# Altium project SMU_V4 - Copy.PrjPcb (part 1 of 2)
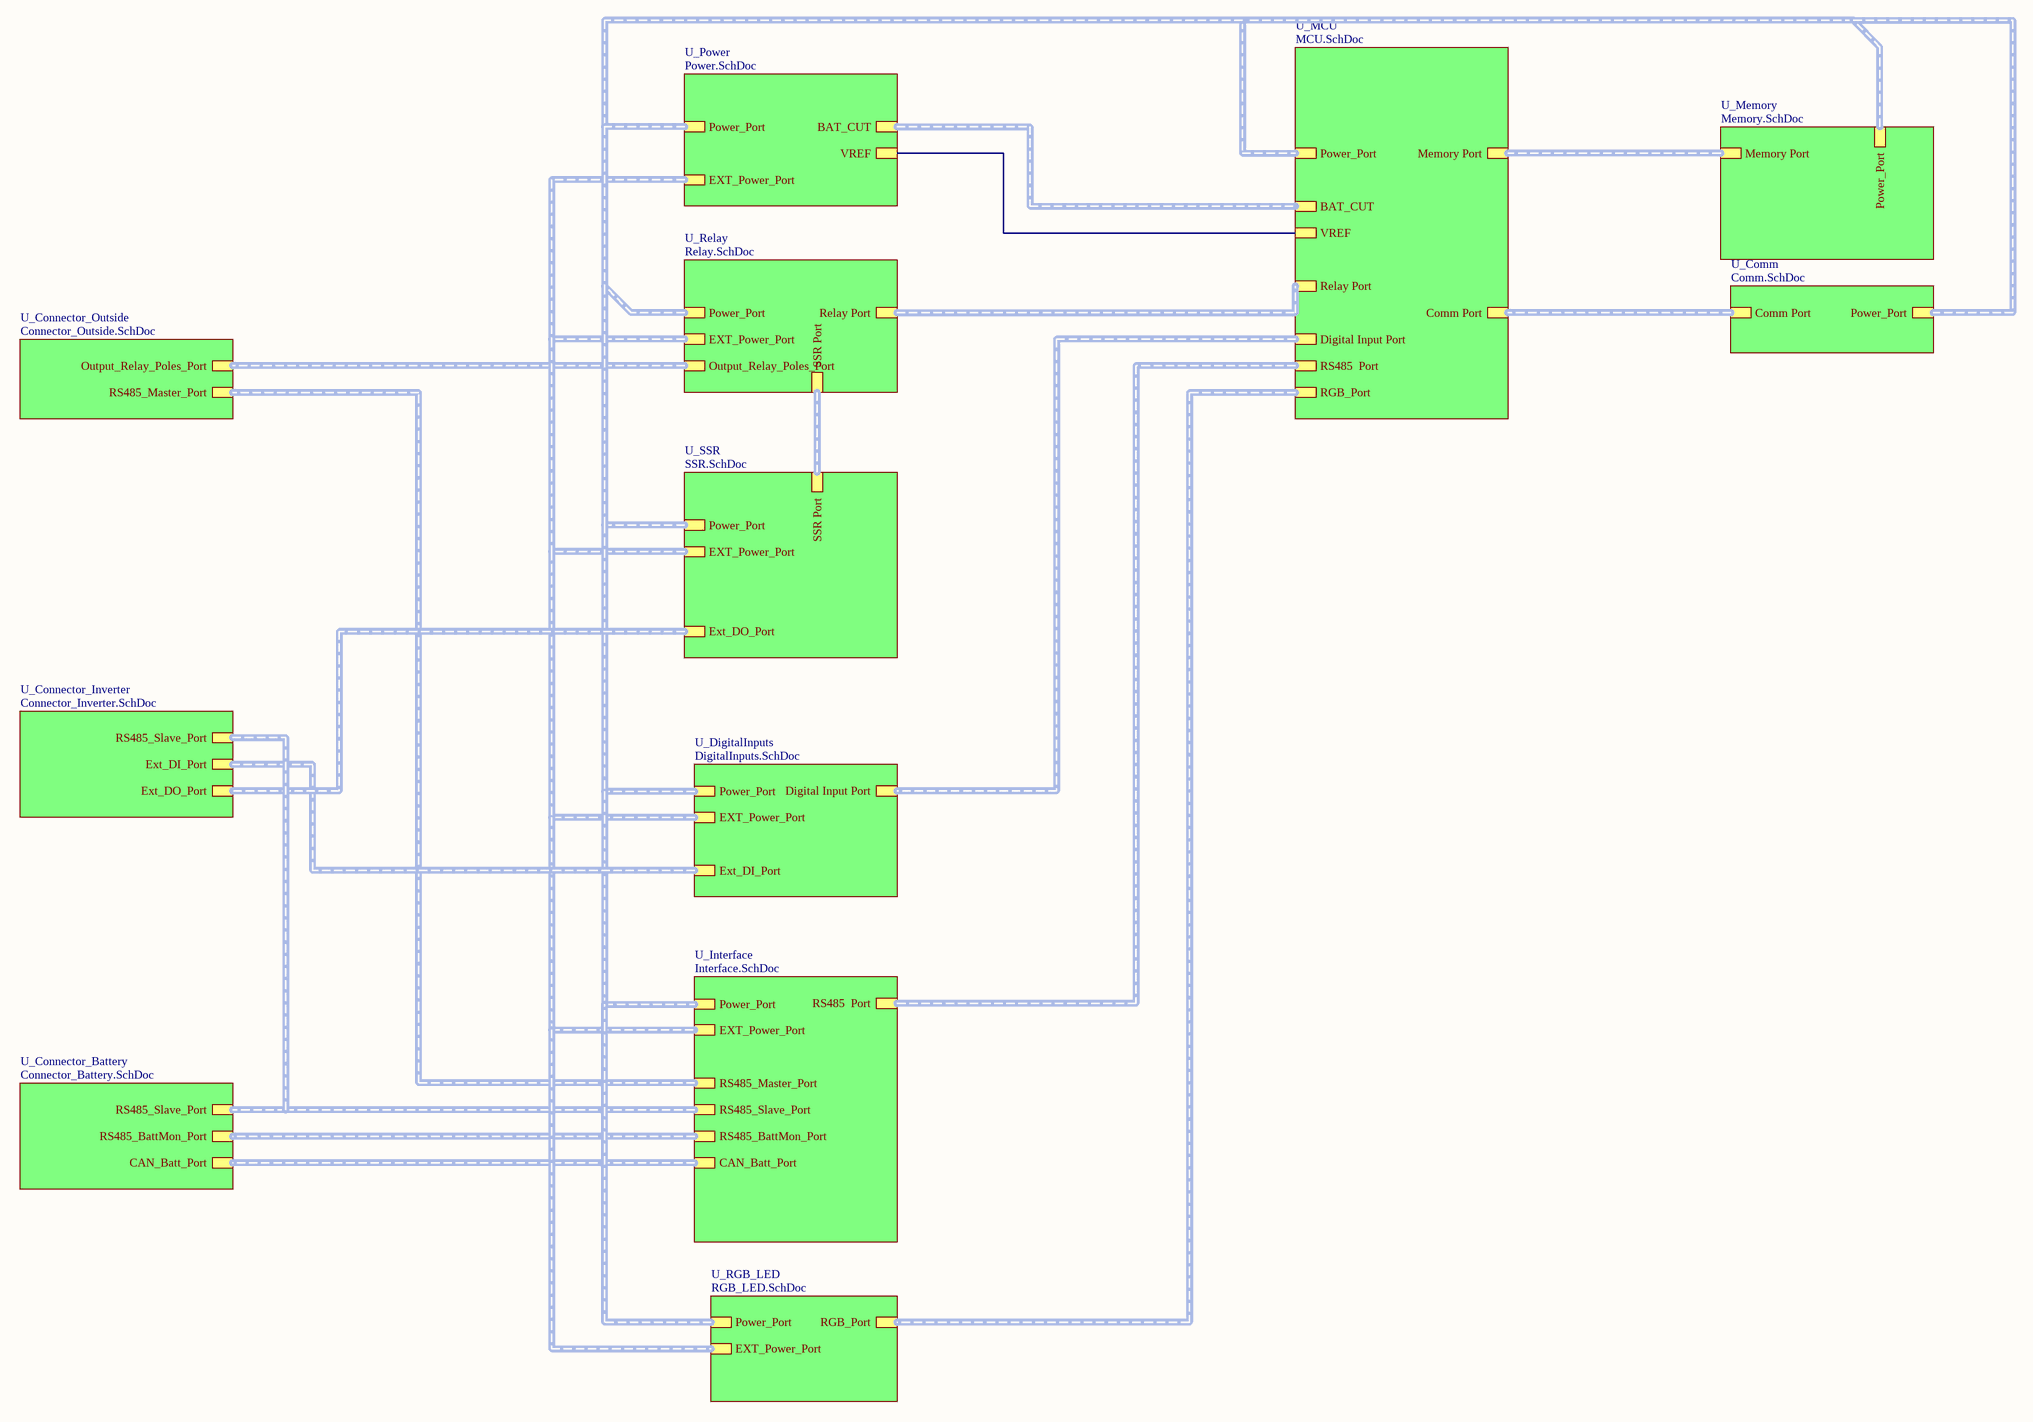
[diagram p0: SMU.SchDoc]
15 sheets, 491 parts. Net scope: hierarchical (ports join the sheet entries above them; power ports are global).
Board file: SMU_V4.PcbDoc
Sheets:
  SMU.SchDoc
    U_Memory = Memory.SchDoc
    U_Power = Power.SchDoc
    U_SSR = SSR.SchDoc
    U_MCU = MCU.SchDoc
    U_Relay = Relay.SchDoc
    U_Comm = Comm.SchDoc
    U_DigitalInputs = DigitalInputs.SchDoc
    U_Interface = Interface.SchDoc
    U_Connector_Outside = Connector_Outside.SchDoc
    U_Connector_Battery = Connector_Battery.SchDoc
    U_Connector_Inverter = Connector_Inverter.SchDoc
    U_RGB_LED = RGB_LED.SchDoc
  SMUTop.SchDoc
  PowerTop.SchDoc

## Sheet SMU.SchDoc
size C; SheetNumber: 1; SheetTotal: 15

### Sub-sheets
U_Comm = Comm.SchDoc: Comm Port (harness Comm_Harness), Power_Port (harness Power_Harness)
U_Connector_Battery = Connector_Battery.SchDoc: RS485_Slave_Port (harness RS485_AB_Harness), RS485_BattMon_Port (harness RS485_AB_Harness), CAN_Batt_Port (harness CAN_HL_Harness)
U_Connector_Inverter = Connector_Inverter.SchDoc: RS485_Slave_Port (harness RS485_AB_Harness), Ext_DI_Port (harness Ext_DI_Harness), Ext_DO_Port (harness Ext_DO_Harness)
U_Connector_Outside = Connector_Outside.SchDoc: Output_Relay_Poles_Port (harness Output_Relay_Poles_Harness), RS485_Master_Port (harness RS485_AB_Harness)
U_DigitalInputs = DigitalInputs.SchDoc: Digital Input Port (harness Digital Input_Harness), EXT_Power_Port (harness EXT_Power_Harness), Power_Port (harness Power_Harness), Ext_DI_Port (harness Ext_DI_Harness)
U_Interface = Interface.SchDoc: RS485  Port (harness RS485_Harness), Power_Port (harness Power_Harness), EXT_Power_Port (harness EXT_Power_Harness), RS485_Master_Port (harness RS485_AB_Harness), RS485_Slave_Port (harness RS485_AB_Harness), RS485_BattMon_Port (harness RS485_AB_Harness), CAN_Batt_Port (harness CAN_HL_Harness)
U_MCU = MCU.SchDoc: Memory Port (harness Memory_Harness), Relay Port (harness Relay_Harness), Power_Port (harness Power_Harness), VREF, BAT_CUT (harness BAT_CUT_Harness), Comm Port (harness Comm_Harness), Digital Input Port (harness Digital Input_Harness), RS485  Port (harness RS485_Harness), RGB_Port (harness RGB_Harness)
U_Memory = Memory.SchDoc: Memory Port (harness Memory_Harness), Power_Port (harness Power_Harness)
U_Power = Power.SchDoc: Power_Port (harness Power_Harness), VREF, BAT_CUT (harness BAT_CUT_Harness), EXT_Power_Port (harness EXT_Power_Harness)
U_Relay = Relay.SchDoc: Relay Port (harness Relay_Harness), SSR Port (harness SSR_Harness), Power_Port (harness Power_Harness), EXT_Power_Port (harness EXT_Power_Harness), Output_Relay_Poles_Port (harness Output_Relay_Poles_Harness)
U_RGB_LED = RGB_LED.SchDoc: Power_Port (harness Power_Harness), EXT_Power_Port (harness EXT_Power_Harness), RGB_Port (harness RGB_Harness)
U_SSR = SSR.SchDoc: SSR Port (harness SSR_Harness), Power_Port (harness Power_Harness), EXT_Power_Port (harness EXT_Power_Harness), Ext_DO_Port (harness Ext_DO_Harness)

### Nets
VREF: sheet U_Power/VREF, sheet U_MCU/VREF

### Buses and harness runs
harness sheet U_Comm/Comm Port = sheet U_MCU/Comm Port
harness sheet U_Comm/Power_Port = sheet U_DigitalInputs/Power_Port = sheet U_Interface/Power_Port = sheet U_MCU/Power_Port = sheet U_Memory/Power_Port = sheet U_Power/Power_Port = sheet U_Relay/Power_Port = sheet U_RGB_LED/Power_Port = sheet U_SSR/Power_Port
harness sheet U_Connector_Battery/CAN_Batt_Port = sheet U_Interface/CAN_Batt_Port
harness sheet U_Connector_Battery/RS485_BattMon_Port = sheet U_Interface/RS485_BattMon_Port
harness sheet U_Connector_Battery/RS485_Slave_Port = sheet U_Connector_Inverter/RS485_Slave_Port = sheet U_Interface/RS485_Slave_Port
harness sheet U_Connector_Inverter/Ext_DI_Port = sheet U_DigitalInputs/Ext_DI_Port
harness sheet U_Connector_Inverter/Ext_DO_Port = sheet U_SSR/Ext_DO_Port
harness sheet U_Connector_Outside/Output_Relay_Poles_Port = sheet U_Relay/Output_Relay_Poles_Port
harness sheet U_Connector_Outside/RS485_Master_Port = sheet U_Interface/RS485_Master_Port
harness sheet U_DigitalInputs/Digital Input Port = sheet U_MCU/Digital Input Port
harness sheet U_DigitalInputs/EXT_Power_Port = sheet U_Interface/EXT_Power_Port = sheet U_Power/EXT_Power_Port = sheet U_Relay/EXT_Power_Port = sheet U_RGB_LED/EXT_Power_Port = sheet U_SSR/EXT_Power_Port
harness sheet U_Interface/RS485  Port = sheet U_MCU/RS485  Port
harness sheet U_MCU/BAT_CUT = sheet U_Power/BAT_CUT
harness sheet U_MCU/Memory Port = sheet U_Memory/Memory Port
harness sheet U_MCU/Relay Port = sheet U_Relay/Relay Port
harness sheet U_MCU/RGB_Port = sheet U_RGB_LED/RGB_Port
harness sheet U_Relay/SSR Port = sheet U_SSR/SSR Port

## Sheet Memory.SchDoc
size B; SheetNumber: 2; SheetTotal: 15
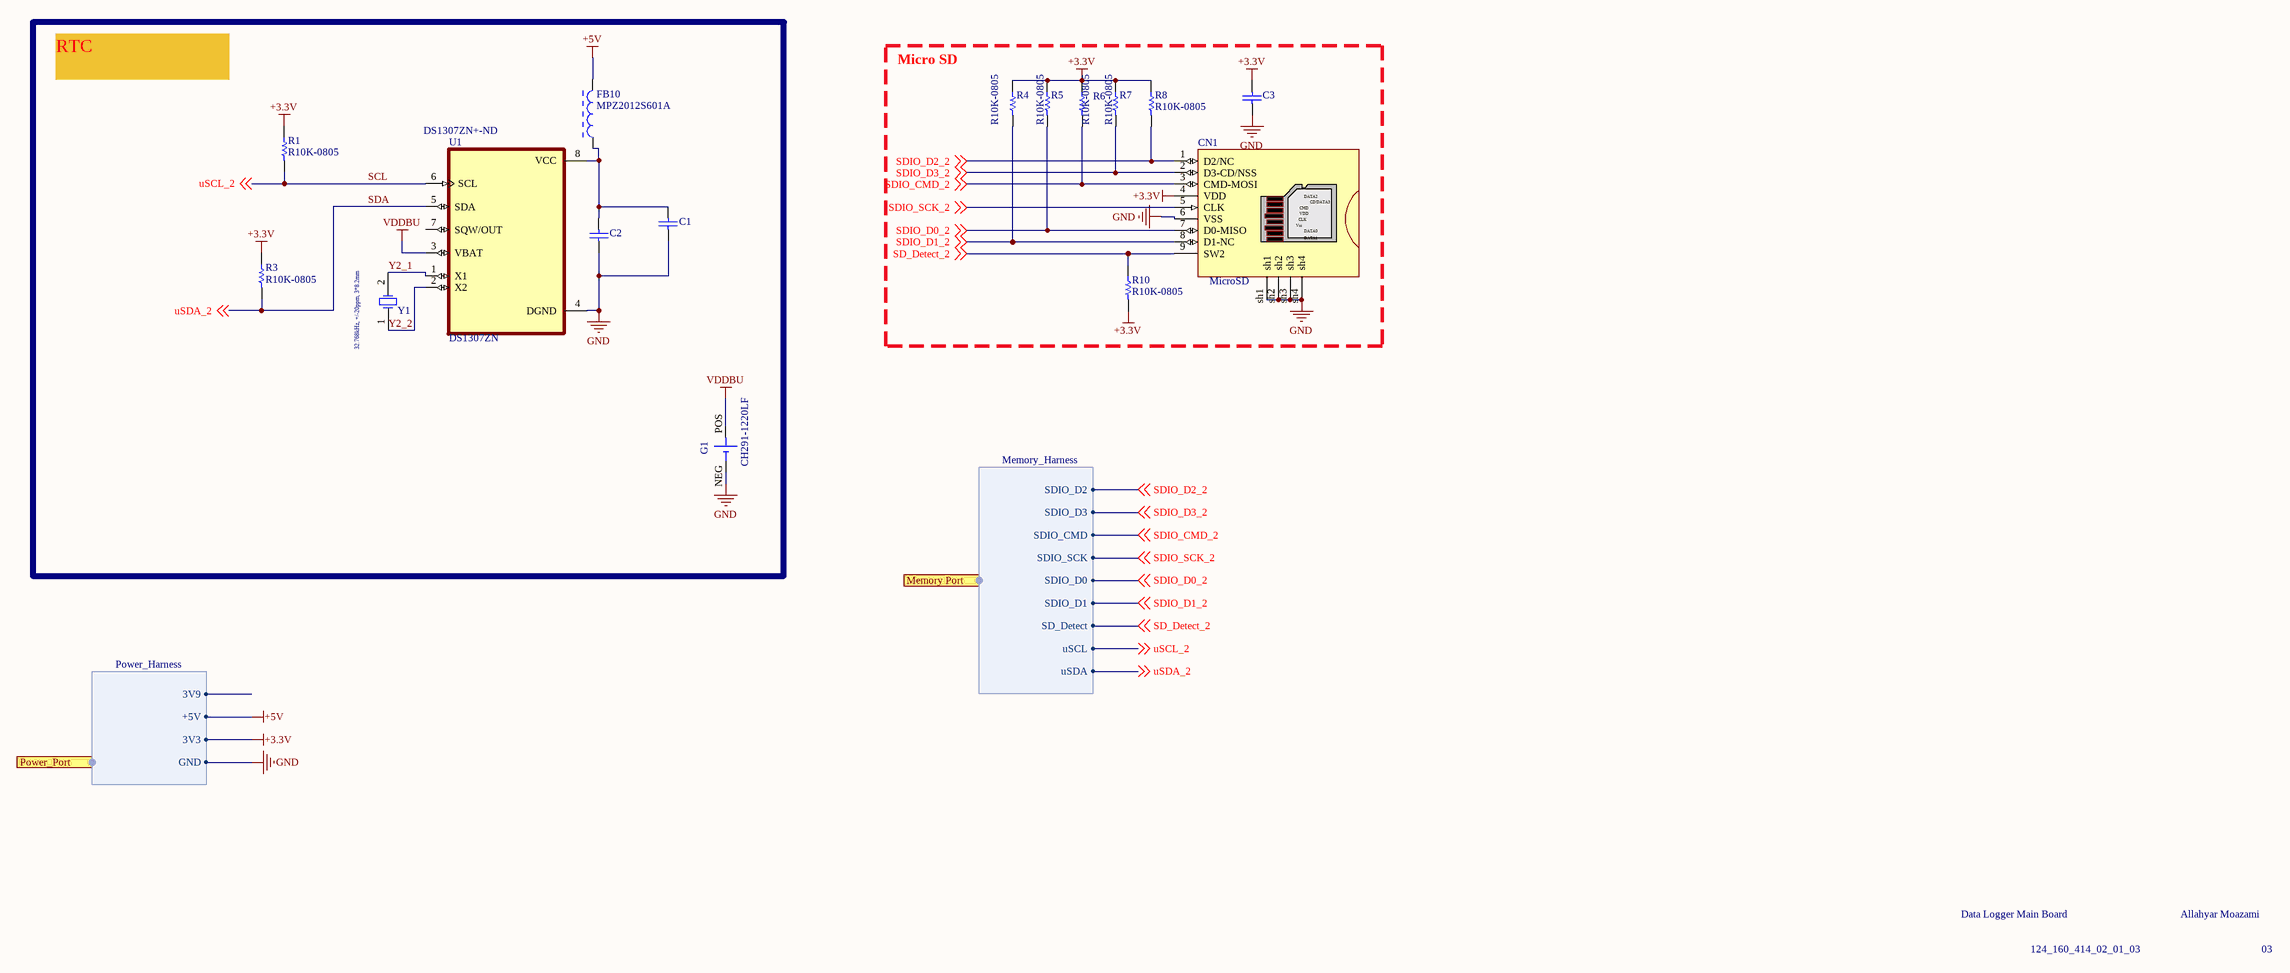
[diagram p1: Memory.SchDoc]

### Parts
C1  (no value)  [CRF06031]
C2  C100nF-0805  [CRF06031]  (value not drawn)
C3  (no value)  [CRF06031]
CN1  MicroSD  [MicroSD]
FB10  MPZ2012S601A  [TDK-MPZ2012_V]
G1  CH291-1220LF  [*CH291-1220LF_CH291-1220LF(Primary)]
R1  R10K-0805  [CRF06031]
R3  R10K-0805  [CRF06031]
R4  R10K-0805  [CRF06031]
R5  R10K-0805  [CRF06031]
R6  R10K-0805  [CRF06031]
R7  R10K-0805  [CRF06031]
R8  R10K-0805  [CRF06031]
R10  R10K-0805  [CRF06031]
U1  DS1307ZN  Supplier Part Number 1: DS1307ZN+-ND  [SOIC127P600X175-8N]
Y1  32.768kHz, +/-20ppm, 3*8.2mm  [WE-XTAL_WATCH_3x8.2]

### Blocks framed on the sheet
Micro SD: C3 CN1 R4-R8 R10

### Ports
Memory Port (harness Memory_Harness), Power_Port (harness Power_Harness)

### Harnesses
Memory_Harness: SDIO_D3, SDIO_CMD, SDIO_SCK, SDIO_D0, SDIO_D1, SD_Detect, uSCL, SDIO_D2, uSDA
Power_Harness: 3V9, +5V, 3V3, GND

### Nets
+3.3V: C3.2 CN1.4(VDD) R1.1 R3.1 R4.1 R5.1 R6.1 R7.1 R8.1 R10.2 ; port Power_Port.3V3
+5V: FB10.2 ; port Power_Port.+5V
GND: C1.1 C2.1 C3.1 CN1.6(VSS) CN1.sh1 CN1.sh2 CN1.sh3 CN1.sh4 G1.NEG U1.4(DGND) ; port Power_Port.GND
VDDBU: G1.POS U1.3(VBAT)
SCL: R1.2 U1.6(SCL) ; off-sheet uSCL_2, port Memory Port.uSCL  [also labelled uSCL_2]
SD_Detect_2: CN1.9(SW2) R10.1 ; off-sheet SD_Detect_2, port Memory Port.SD_Detect
SDA: R3.2 U1.5(SDA) ; off-sheet uSDA_2, port Memory Port.uSDA  [also labelled uSDA_2]
SDIO_CMD_2: CN1.3(CMD-MOSI) R6.2 ; off-sheet SDIO_CMD_2, port Memory Port.SDIO_CMD
SDIO_D0_2: CN1.7(D0-MISO) R5.2 ; off-sheet SDIO_D0_2, port Memory Port.SDIO_D0
SDIO_D1_2: CN1.8(D1-NC) R4.2 ; off-sheet SDIO_D1_2, port Memory Port.SDIO_D1
SDIO_D2_2: CN1.1(D2/NC) R8.2 ; off-sheet SDIO_D2_2, port Memory Port.SDIO_D2
SDIO_D3_2: CN1.2(D3-CD/NSS) R7.2 ; off-sheet SDIO_D3_2, port Memory Port.SDIO_D3
SDIO_SCK_2: CN1.5(CLK) ; off-sheet SDIO_SCK_2, port Memory Port.SDIO_SCK
Y2_1: U1.1(X1) Y1.2(OSC2)
Y2_2: U1.2(X2) Y1.1(OSC1)
NetC1_2: C1.2 C2.2 FB10.1 U1.8(VCC)

Not connected (* = marked no-connect by the designer): U1 7(SQW/OUT)

### Notes on the sheet
- RTC
- Data Logger Main Board
- Allahyar Moazami
- 124_160_414_02_01_03
- 03
- (in symbol MicroSD) DATA2; CD/DATA3; CMD; Vss; DATA0; DATA1

### Library data of the parts
C1-C3 = Cap: Capacitor; Manufacturer_P/N: GCM21BR72A104KA37L; Digi-Key_Part_Number: 490-4789-1-ND; JLC P/N: C85866
  C1 C2: ClassName: RTC
  C3: ClassName: SD
CN1 = MicroSD: MicroSD,9 pin; Manufacturer_P/N: MSD-4-A; Digi-Key_Part_Number: 2223-MSD-4-ATR-ND; ClassName: SD; JLC P/N: C22367949
FB10 = CMP-2000-05400-1: Chip Bead for Power Line, 600 Ohm, +/- 25%, 2 A, -55 to 125 degC, 2-Pin SMD (0805), RoHS, Tape and Reel; Manufacturer_P/N: MPZ2012S601AT000; Maximum DC Current: 2A; Maximum DC Resistance: 100mOhms; Manufacturer URL: http://www.tdk.com/; Product: FerriteChipBeads; Digi-Key_Part_Number: 445-MPZ2012S601AT000TR-ND; ClassName: RTC; JLC P/N: C21519
G1 = CH291-1220LF: BATTERY HOLDER, SMT, 12MM; Accessory Type: Coin Cell Battery Holder; For Use With: 1220 Coin Cell Batteries; Battery ...; Manufacturer_P/N: S8411-45R; MF: Multicomp; MP: CH291-1220LF; ClassName: RTC; Digi-Key_Part_Number: 952-1745-2-ND; JLC P/N: C5199899
R1 R3-R8 R10 = Res1: Resistor; Manufacturer_P/N: RC0805FR-1310KL; Digi-Key_Part_Number: 13-RC0805FR-1310KLTR-ND; JLC P/N: C4121085
  R1 R3: ClassName: RTC
  R4-R8 R10: ClassName: SD
U1 = DS1307ZN: Real Time Clock _RTC_ IC Clock/Calendar 56B IÂ²C, 2-Wire Serial 8-SOIC _0.154, 3.90mm Width_; MP: DS1307ZN+; MF: Maxim Integrated; ClassName: RTC; Digi-Key_Part_Number: DS1307ZN+-ND; Supplier 1: Digikey; Manufacturer_P/N: DS1307ZN+; JLC P/N: C3304433
Y1 = 830002995B: dip; Manufacturer_P/N: ECS-.327-CDX-1038; Part Number: 830002995B; ClassName: RTC; Digi-Key_Part_Number: XC2121-ND; JLC P/N: C2636480

## Sheet Power.SchDoc
size C; SheetNumber: 3; SheetTotal: 15
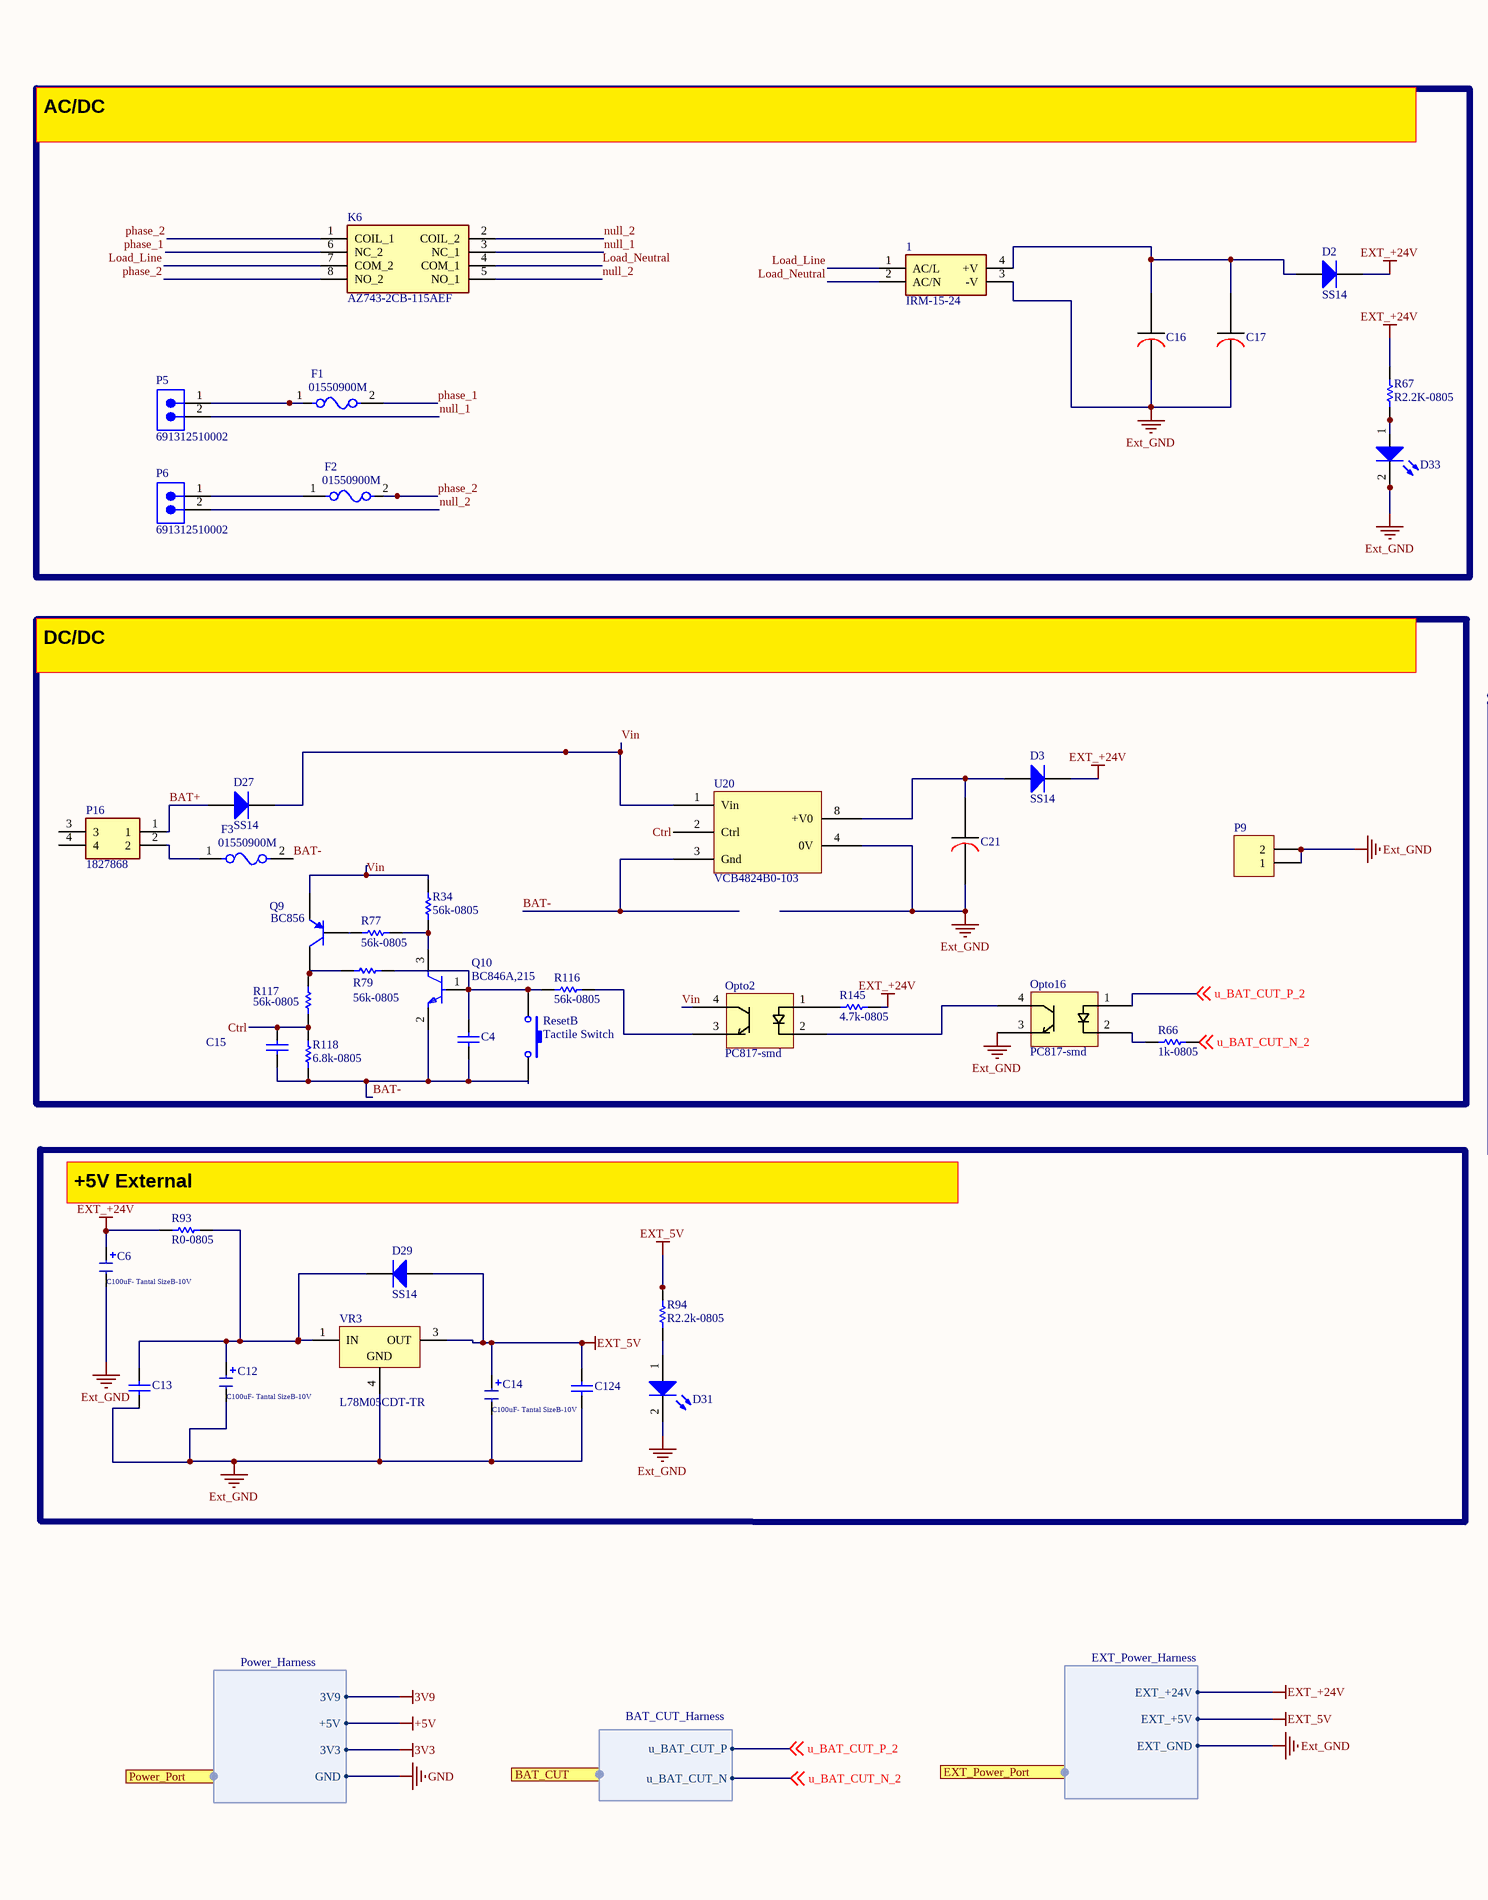
[diagram p2: Power.SchDoc, left]
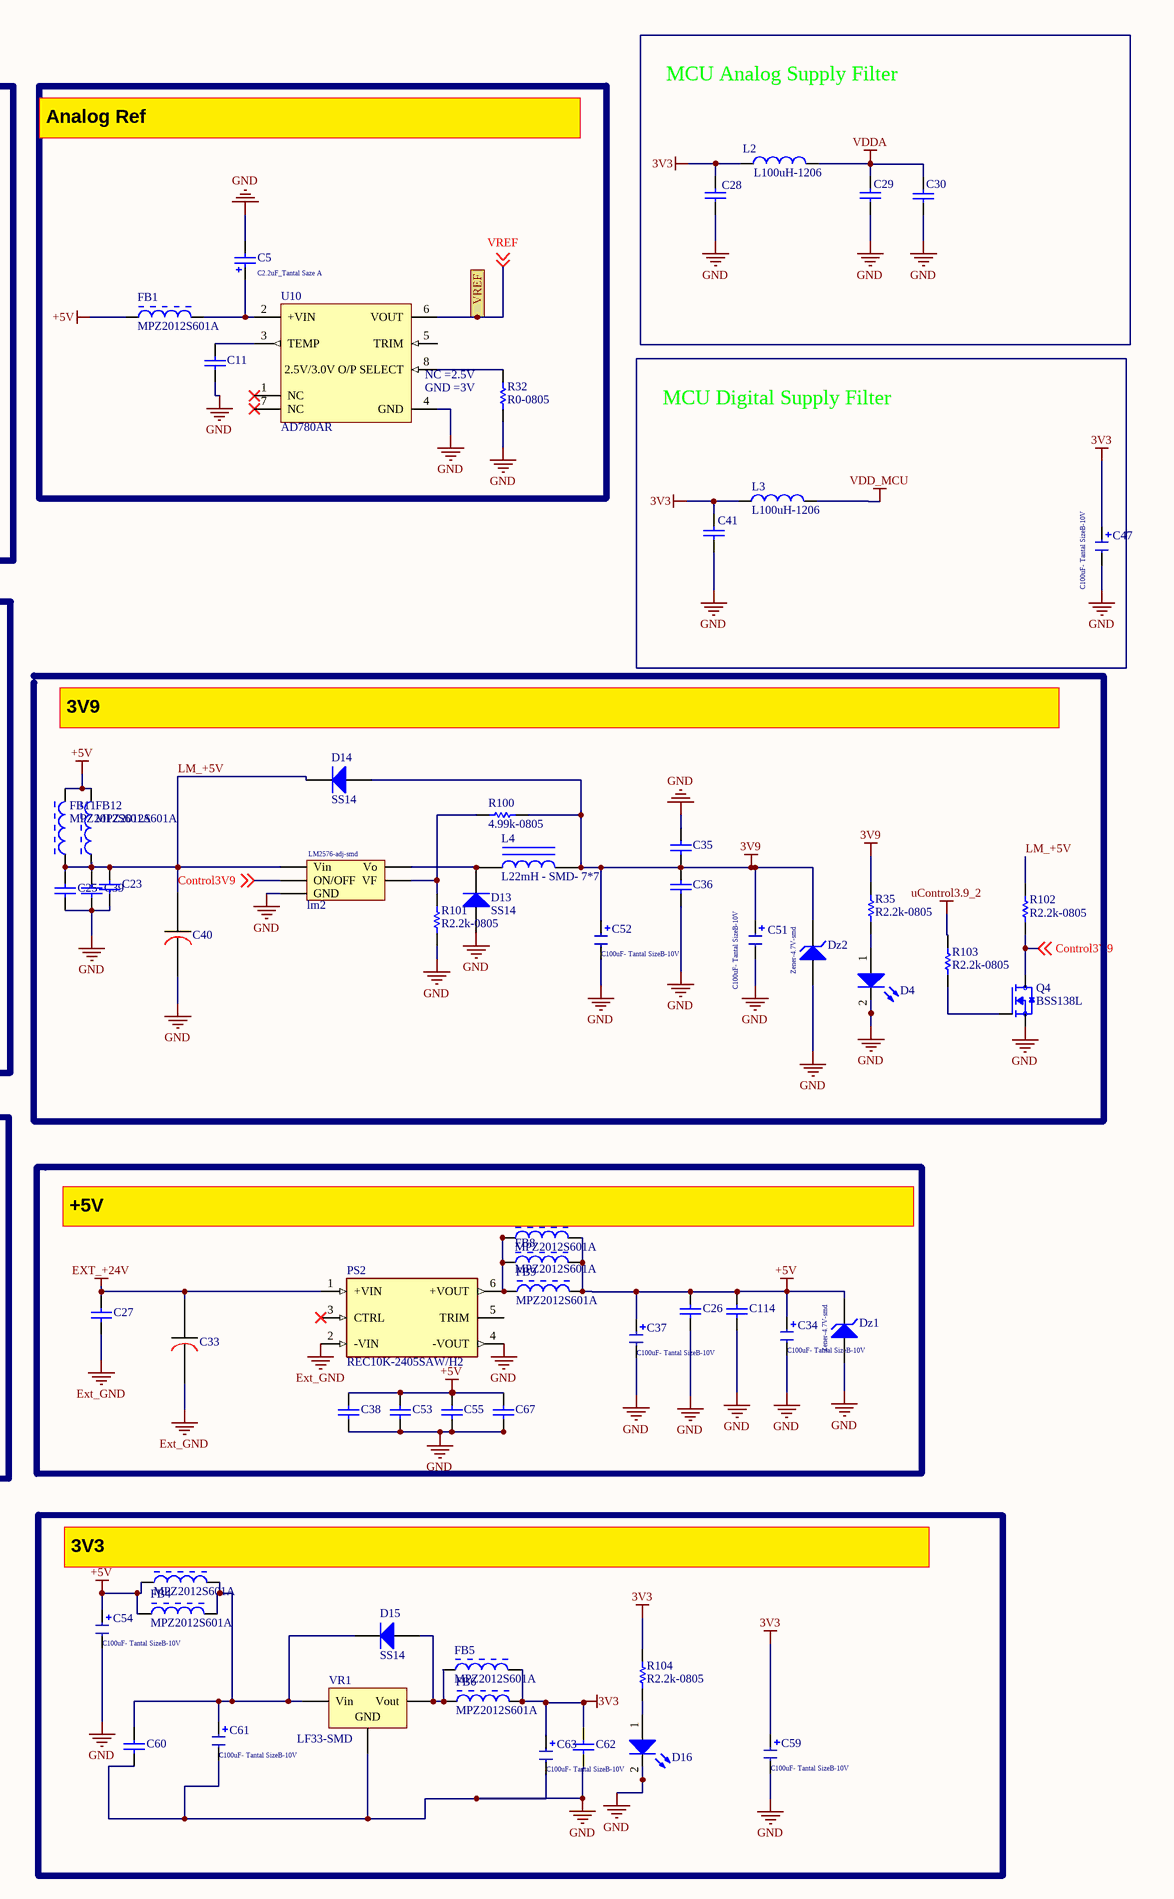
[diagram p3: Power.SchDoc, right]

### Parts
1  IRM-15-24  [IRM-15-5]
C4  (no value)  [CRF06031]
C5  C2.2uF_Tantal Saze A  [Tantalium Size A]
C6  C100uF- Tantal SizeB-10V  [Tantalium Size B]
C11  (no value)  [CRF06031]
C12  C100uF- Tantal SizeB-10V  [Tantalium Size B]
C13  (no value)  [CRF06031]
C14  C100uF- Tantal SizeB-10V  [Tantalium Size B]
C15  (no value)  [CRF06031]
C16  C100uF-50V  [CAPACITOR RADIAL SMT size F]  (value not drawn)
C17  C100uF-50V  [CAPACITOR RADIAL SMT size F]  (value not drawn)
C21  C100uF-50V  [CAPACITOR RADIAL SMT size F]  (value not drawn)
C23  (no value)  [CRF06031]
C25  (no value)  [CRF06031]
C26  (no value)  [CRF06031]
C27  (no value)  [CRF06031]
C28  (no value)  [CRF06031]
C29  (no value)  [CRF06031]
C30  (no value)  [CRF06031]
C33  C100uF-50V  [CAPACITOR RADIAL SMT size F]  (value not drawn)
C34  C100uF- Tantal SizeB-10V  [Tantalium Size B]
C35  (no value)  [CRF06031]
C36  (no value)  [CRF06031]
C37  C100uF- Tantal SizeB-10V  [Tantalium Size B]
C38  (no value)  [CRF06031]
C39  (no value)  [CRF06031]
C40  C100uF-50V  [CAPACITOR RADIAL SMT size F]  (value not drawn)
C41  (no value)  [CRF06031]
C47  C100uF- Tantal SizeB-10V  [Tantalium Size B]
C51  C100uF- Tantal SizeB-10V  [Tantalium Size B]
C52  C100uF- Tantal SizeB-10V  [Tantalium Size B]
C53  (no value)  [CRF06031]
C54  C100uF- Tantal SizeB-10V  [Tantalium Size B]
C55  (no value)  [CRF06031]
C59  C100uF- Tantal SizeB-10V  [Tantalium Size B]
C60  (no value)  [CRF06031]
C61  C100uF- Tantal SizeB-10V  [Tantalium Size B]
C62  (no value)  [CRF06031]
C63  C100uF- Tantal SizeB-10V  [Tantalium Size B]
C67  (no value)  [CRF06031]
C114  (no value)  [CRF06031]
C124  (no value)  [CRF06031]
D2  SS14  [ind]
D3  SS14  [ind]
D4  LED_0805_green  [0805-LED]  (value not drawn)
D13  SS14  [ind]
D14  SS14  [ind]
D15  SS14  [ind]
D16  LED_0805_green  [0805-LED]  (value not drawn)
D27  SS14  [ind]
D29  SS14  [ind]
D31  LED_0805_green  [0805-LED]  (value not drawn)
D33  LED_0805_green  [0805-LED]  (value not drawn)
Dz1  Zener-4.7V-smd  [ind]
Dz2  Zener-4.7V-smd  [ind]
F1  01550900M  [FP-0155-MFG]
F2  01550900M  [FP-0155-MFG]
F3  01550900M  [FP-0155-MFG]
FB1  MPZ2012S601A  [TDK-MPZ2012_V]
FB3  MPZ2012S601A  [TDK-MPZ2012_V]
FB4  MPZ2012S601A  [TDK-MPZ2012_V]
FB5  MPZ2012S601A  [TDK-MPZ2012_V]
FB6  MPZ2012S601A  [TDK-MPZ2012_V]
FB7  MPZ2012S601A  [TDK-MPZ2012_V]
FB8  MPZ2012S601A  [TDK-MPZ2012_V]
FB9  MPZ2012S601A  [TDK-MPZ2012_V]
FB11  MPZ2012S601A  [TDK-MPZ2012_V]
FB12  MPZ2012S601A  [TDK-MPZ2012_V]
K6  AZ743-2CB-115AEF  [AZ7432CB115AEF]
L2  L100uH-1206  [crf1206]
L3  L100uH-1206  [crf1206]
L4  L22mH - SMD- 7*7  [LM_810]
lm2  LM2576-adj-smd  [lm2576 - SMD]
Opto2  PC817-smd  [PC817_SMD1]
Opto16  PC817-smd  [PC817_SMD1]
P5  691312510002  [691312510002]
P6  691312510002  [691312510002]
P9  DNP  [HDR1X2]  (value not drawn)
P16  1827868  [1827868]
PS2  REC10K-2405SAW/H2  [CONV_REC10K-2405SAW/H2]
Q4  BSS138L  [BSS138L]
Q9  BC856  [NXP-SOT23-3_V]
Q10  BC846A,215  [FP-SOT23-MFG]
R32  R0-0805  [CRF06031]
R34  56k-0805  [CRF06031]
R35  R2.2k-0805  [CRF06031]
R66  1k-0805  [CRF06031]
R67  R2.2K-0805  [CRF06031]
R77  56k-0805  [CRF06031]
R79  56k-0805  [CRF06031]
R93  R0-0805  [CRF06031]
R94  R2.2k-0805  [CRF06031]
R100  4.99k-0805  [CRF06031]
R101  R2.2k-0805  [CRF06031]
R102  R2.2k-0805  [CRF06031]
R103  R2.2k-0805  [CRF06031]
R104  R2.2k-0805  [CRF06031]
R116  56k-0805  [CRF06031]
R117  56k-0805  [CRF06031]
R118  6.8k-0805  [CRF06031]
R145  4.7k-0805  [CRF06031]
ResetB  Tactile Switch  [CRF06031]
U10  AD780AR  [SOIC-8]
U20  VCB4824B0-103  [VCB4824SB0-10WR3]
VR1  LF33-SMD  [LM7805 - smd]
VR3  L78M05CDT-TR  [TO-252_L]

### Ports
BAT_CUT (harness BAT_CUT_Harness), EXT_Power_Port (harness EXT_Power_Harness), Power_Port (harness Power_Harness), VREF

### Harnesses
Power_Harness: 3V9, +5V, 3V3, GND
BAT_CUT_Harness: u_BAT_CUT_P, u_BAT_CUT_N
EXT_Power_Harness: EXT_+24V, EXT_+5V, EXT_GND

### Nets
3V3: C28.1 C41.1 C47.1 C59.1 C62.1 C63.1 FB5.2 FB6.2 L2.1 L3.1 R104.1 ; port Power_Port.3V3  [project net +3.3V]
3V9: C35.2 C36.2 C51.1 C52.1 D14.1(A) Dz2.2(K) L4.2 R35.1 R100.1 ; port Power_Port.3V9
+5V: C26.2 C34.1 C37.1 C38.1 C53.1 C54.1 C55.1 C67.1 C114.2 Dz1.2(K) FB1.1 FB3.1 FB4.1 FB7.2 FB8.2 FB9.2 FB11.2 FB12.2 ; port Power_Port.+5V
EXT_5V: C14.1 C124.1 D29.1(A) R94.1 VR3.3(OUT) ; port EXT_Power_Port.EXT_+5V
EXT_+24V: C6.1 C27.2 C33.1 D2.2(K) D3.2(K) PS2.1(+VIN) R67.1 R93.1 R145.1 ; port EXT_Power_Port.EXT_+24V
Ext_GND: 1.3(-V) C6.2 C12.2 C13.2 C14.2 C16.2 C17.2 C21.2 C27.1 C33.2 C124.2 D31.2(K) D33.2(K) Opto16.3 P9.1 P9.2 PS2.2(-VIN) U20.4(0V) VR3.4(GND) ; port EXT_Power_Port.EXT_GND
GND: C5.2 C11.2 C23.1 C25.1 C26.1 C28.2 C29.2 C30.2 C34.2 C35.1 C36.1 C37.2 C38.2 C39.1 C40.2 C41.2 C47.2 C51.2 C52.2 C53.2 C54.2 C55.2 C59.2 C60.2 C61.2 C62.2 C63.2 C67.2 C114.1 D4.2(K) D13.1(A) D16.2(K) Dz1.1(A) Dz2.1(A) lm2.3(GND) PS2.4(-VOUT) Q4.S R32.2 R101.2 U10.4(GND) VR1.2(GND) ; port Power_Port.GND
uControl3.9_2: R103.1
VDD_MCU: L3.2
VDDA: C29.1 C30.1 L2.2
BAT+: D27.1(A) P16.1
BAT-: C4.2 C15.2 F3.2 Q10.2(E) R118.1 ResetB.2 U20.3(Gnd)
Control3V9: lm2.5(ON/OFF) Q4.D R102.2 ; off-sheet Control3V9
Ctrl: C15.1 R117.1 R118.2 U20.2(Ctrl)
LM_+5V: C23.2 C25.2 C39.2 C40.1 D14.2(K) FB11.1 FB12.1 lm2.1(Vin) R102.1
Load_Line: 1.1(AC/L) K6.7(COM_2)
Load_Neutral: 1.2(AC/N) K6.4(COM_1)
null_1: K6.3(NC_1) P5.2
null_2: K6.2(COIL_2) K6.5(NO_1) P6.2
phase_1: F1.2 K6.6(NC_2)
phase_2: F2.2 K6.1(COIL_1) K6.8(NO_2)
u_BAT_CUT_N_2: R66.1 ; off-sheet u_BAT_CUT_N_2, port BAT_CUT.u_BAT_CUT_N
u_BAT_CUT_P_2: Opto16.1 ; off-sheet u_BAT_CUT_P_2, port BAT_CUT.u_BAT_CUT_P
Vin: D27.2(K) Opto2.4 Q9.2(E) R34.2 U20.1(Vin)
VREF: U10.6(VOUT) ; off-sheet VREF, port VREF
Net1_4: 1.4(+V) C16.1 C17.1 D2.1(A)
NetC4_1: C4.1 Q10.1(B) R79.1 R116.2 ResetB.1
NetC5_1: C5.1 FB1.2 U10.2(+VIN)
NetC11_1: C11.1 U10.3(TEMP)
NetC12_1: C12.1 C13.1 D29.2(K) R93.2 VR3.1(IN)
NetC21_1: C21.1 D3.1(A) U20.8(+V0)
NetC60_1: C60.1 C61.1 D15.2(K) FB3.2 FB4.2 VR1.1(Vin)
NetD4_1: D4.1(A) R35.2
NetD13_2: D13.2(K) L4.1 lm2.2(Vo)
NetD15_1: D15.1(A) FB5.1 FB6.1 VR1.3(Vout)
NetD16_1: D16.1(A) R104.2
NetD31_1: D31.1(A) R94.2
NetD33_1: D33.1(A) R67.2
NetF1_1: F1.1 P5.1
NetF2_1: F2.1 P6.1
NetF3_1: F3.1 P16.2
NetFB7_1: FB7.1 FB8.1 FB9.1 PS2.6(+VOUT)
Netlm2_4: lm2.4(VF) R100.2 R101.1
NetOpto2_1: Opto2.1 R145.2
NetOpto2_2: Opto2.2 Opto16.4
NetOpto2_3: Opto2.3 R116.1
NetOpto16_2: Opto16.2 R66.2
NetQ4_G: Q4.G R103.2
NetQ9_1: Q9.1(B) R77.2
NetQ9_3: Q9.3(C) R79.2 R117.2
NetQ10_3: Q10.3(C) R34.1 R77.1
NetR32_1: R32.1 U10.8(2.5V/3.0V_O/P_SELECT)

Not connected (* = marked no-connect by the designer): P16 3 4; PS2 3(CTRL)* 5(TRIM); U10 1(NC)* 5(TRIM) 7(NC)*

### Notes on the sheet
- AC/DC
- Analog Ref
- MCU Analog Supply Filter
- (near U10) NC =2.5V
- (near U10) GND =3V
- MCU Digital Supply Filter
- DC/DC
- 3V9
- (near R93) +5V External
- (near FB7) +5V
- (near FB3) 3V3

### Library data of the parts
1 = IRM-15-24: Power Supply; Manufacturer_Name: Mean Well; Manufacturer_Part_Number: IRM-15-24; Mouser Part Number: 709-IRM15-24; Arrow Part Number: IRM-15-24; Digi-Key_Part_Number: 1866-3035-ND; Manufacturer_P/N: IRM-15-24; JLC P/N: C7211221
C4 C11 C13 C15 C23 C25-C30 C35 C36 C38 C39 C41 C53 C55 C60 C62 C67 C114 C124 = Cap: as C1 on sheet Memory; Digi-Key_Part_Number: 490-4789-1-ND; JLC P/N: C85866
  C4 C15: ClassName: BAT/24
  C11: ClassName: AnalogRef
  C13 C124: ClassName: 5V External
  C23 C25 C35 C36 C39: ClassName: Sim7600
  C27: ClassName: Iso_5v
  C60 C62: ClassName: 3v3
C5 = Cap_10uF_POL_10%_TANA: Polarized Capacitor,2.2uF,10VtypeA; Manuf_1: VISHAY; Manuf_Part_1: 293D106X9010A2TE3; Manufacturer_P/N: 293D225X0016A2TE3; Revision: July-2002: Re-released for DXP Platform.; ClassName: AnalogRef; Digi-Key_Part_Number: 718-2135-2-ND; JLC P/N: C1954029
C6 C12 C14 C34 C37 C47 C51 C52 C54 C59 C61 C63 = Capacitor Tantalium: Manufacturer_P/N: TMCMB1A107MTRF; JLC P/N: C4986978
  C6: ClassName: 5V External; Digi-Key_Part_Number: 718-2425-2-ND
  C12 C14: ClassName: 5V External; Digi-Key_Part_Number: 718-2425-1-ND
  C34: Digi-Key_Part_Number: 718-2425-1-ND
  C37 C47: Digi-Key_Part_Number: 718-2425-2-ND
  C51 C52: ClassName: Sim7600; Digi-Key_Part_Number: 718-2425-2-ND
  C54 C59 C61 C63: ClassName: 3v3; Digi-Key_Part_Number: 718-2425-2-ND
C16 C17 C21 C33 C40 = CAP_E_SMD: SMD_Electrolyt; Manufacturer_P/N: EEE-HD1H101P; Digi-Key_Part_Number: PCE4980CT-ND; JLC P/N: C401850
  C16 C17: ClassName: AC/DC
  C21: ClassName: BAT/24
  C33: ClassName: Iso_5v
  C40: ClassName: Sim7600
D2 D3 D13-D15 D27 D29 = Diode: Default Diode; Digi-Key_Part_Number: SS14TR-ND; Manufacturer_P/N: SS14
  D2: ClassName: AC/DC
  D13 D14: ClassName: Sim7600
  D15: ClassName: 3v3
  D27: ClassName: BAT/24
  D29: ClassName: 5V External
D4 D16 D31 D33 = LED_0805: Manufacturer_P/N: NCD0805R1; JLC P/N: C84256
  D4: ClassName: Sim7600
  D16: ClassName: 3v3
  D31: ClassName: 5V External
Dz1 Dz2 = D Zener: Zener Diode; Manufacturer_P/N: MM3Z4V7ST1G; Digi-Key_Part_Number: MM3Z4V7ST1GOSTR-ND; JLC P/N: C154578
  Dz1: ClassName: Iso_5v
  Dz2: ClassName: Sim7600
F1-F3 = CMP-08604-000021-1: FUSE BLOK CARTRIDGE 125V 10A SMD; Octopart: https://octopart.com/01550900m-littelfuse-9291575; Digikey Description: FUSE BLOK CARTRIDGE 125V 10A SMD; Manufacturer Part Number: 01550900M; Mouser Description: Fuse Holder ACS NANO HLDR; Digi-Key_Part_Number: F1889-ND; Manufacturer_P/N: 01550900M; JLC P/N: C108518
FB1 FB3-FB9 FB11 FB12 = CMP-2000-05400-1: as FB10 on sheet Memory; Manufacturer URL: http://www.tdk.com/; Product: FerriteChipBeads; Digi-Key_Part_Number: 445-MPZ2012S601AT000TR-ND; JLC P/N: C21519
  FB3-FB6: ClassName: 3v3
  FB7-FB9: ClassName: Iso_5v
  FB11 FB12: ClassName: Sim7600
K6 = AZ743-2CB-115AEF: Relay or Contactor; Manufacturer_Name: Zettler Group; Manufacturer_Part_Number: AZ743-2CB-115AEF; Digi-Key_Part_Number: 3385-AZ743-2CB-115AEF-ND; Manufacturer_P/N: AZ743-2CB-115AEF; JLC P/N: C20260853
L2 L3 = Inductor: Manufacturer_P/N: CBC3225T101MR; Digi-Key_Part_Number: 587-1628-2-ND; JLC P/N: C90316
L4 = Inductor Iron: Magnetic-Core Inductor; Manufacturer_P/N: SRR7045-220M; ClassName: Sim7600; Digi-Key_Part_Number: SRR7045-220MTR-ND; JLC P/N: C1332212
lm2 = LM2576: Manufacturer_P/N: LM2576SX-ADJ/NOPB; ClassName: Sim7600; Digi-Key_Part_Number: LM2576SX-ADJ/NOPBTR-ND; JLC P/N: C12619
Opto2 Opto16 = PC817: Manufacturer_P/N: APC-817D1-SL; Digi-Key_Part_Number: 2007-APC-817D1-SLTR-ND; JLC P/N: C17448553
  Opto2: ClassName: BAT/24
P5 P6 = CMP-1502-02169-2: Mount: Through Hole; Digi-Key_Part_Number: 732-2064-ND; Manufacturer_P/N: 691312510002; JLC P/N: C5439729
P9 = Header 2: ClassName: AC/DC
P16 = 1827868: Connector; Manufacturer_Name: Phoenix Contact; Manufacturer_Part_Number: 1827868; Mouser Part Number: 651-1827868; Arrow Part Number: 1827868; Digi-Key_Part_Number: 277-5745-ND; Manufacturer_P/N: 1827868; JLC P/N: C3585934
PS2 = REC10K-2405SAW/H2: 10W DC/DC-Converter 'ECONOLINE' 1x1 1.6kV reg 4:1; MF: Recom Power; MP: REC10K-2405SAW/H2; ClassName: Iso_5v; Digi-Key_Part_Number: 945-REC10K-2405SAW/H2-ND; Manufacturer_P/N: REC10K-2405SAW/H2
Q4 = BSS138L: N-Channel 50V 200mA _Ta_ 350mW _Ta_ Surface Mount SOT-23-3; MF: ON Semiconductor; MP: BSS138L; ClassName: Sim7600; Digi-Key_Part_Number: BSS138LTR-ND; Manufacturer_P/N: BSS138L; JLC P/N: C890265
Q9 = CMP-2000-05936-1: PNP General Purpose Transistor, 65 V, -65 to 150 degC, 3-Pin SOT23, RoHS; Manufacturer_P/N: BC856C; SVHC: NoSVHC(19-Dec-2012); Manufacturer URL: http://www.nxp.com/; Digi-Key_Part_Number: 4878-BC856CTR-ND; JLC P/N: C181145
Q10 = CMP-14406-000010-1: TRANS NPN 65V 0.1A SOT23; Temperature: to +150°C; Octopart: https://octopart.com/bc846a%2C215-nexperia-78739089; Digikey Description: TRANS NPN 65V 0.1A SOT23; Manufacturer Part Number: BC846A,215; Ambient Temperature Range Low: -65°C; Mouser Description: BC846 Series 65 V 100 mA NPN SMT General Purpose Transistor - SOT-23; Ambient Temperature Range High: +150°C; Digi-Key_Part_Number: 1727-4239-2-ND; Manufacturer_P/N: BC846A,215; JLC P/N: C90281
R32 R93 = Res1: Resistor; Manufacturer_P/N: RC0805FR-070RL; Digi-Key_Part_Number: 311-0.0CRTR-ND; JLC P/N: C100045
  R32: ClassName: AnalogRef
  R93: ClassName: 5V External
R34 R77 R79 R116 R117 = Res1: Resistor; Manufacturer_P/N: RC0805FR-0756KL; ClassName: BAT/24; Digi-Key_Part_Number: 311-56.0KCRTR-ND; JLC P/N: C137509
R35 R67 R94 R101-R104 = Res1: Resistor; Manufacturer_P/N: RC0805FR-072K2L; Digi-Key_Part_Number: 311-2.20KCRTR-ND; JLC P/N: C114561
  R35 R101-R103: ClassName: Sim7600
  R94: ClassName: 5V External
  R104: ClassName: 3v3
R66 = Res1: Resistor; Manufacturer_P/N: RC0805FR-071KL; Digi-Key_Part_Number: 311-1.00KCRTR-ND; JLC P/N: C95781
R100 R145 = Res1: Resistor; Manufacturer_P/N: RC0805FR-074K7L; Digi-Key_Part_Number: 311-4.70KCRTR-ND; JLC P/N: C60816
  R100: ClassName: Sim7600
  R145: ClassName: BAT/24
R118 = Res1: Resistor; Manufacturer_P/N: RC0805FR-076K8L; ClassName: BAT/24; Digi-Key_Part_Number: 311-6.80KCRTR-ND; JLC P/N: C114550
ResetB = Switch PB: Manufacturer_P/N: 430152043836; Digi-Key_Part_Number: 732-6992-2-ND; JLC P/N: C6687535
U10 = AD780AR: High Precision Reference, 2.5 or 3 V Output, 4 to 36 V Supply, Industrial, 8-pin SOIC (R-8), Tube; Manufacturer_P/N: AD780ARZ; Max V Supply (V): 36; Min V Supply (V): 4; Supplier 1: Digi-Key; Supplier Part Number 1: AD780AR-ND; Supplier 2: Mouser; Supplier Part Number 2: 584-AD780AR; PartNumber: AD780AR; ClassName: AnalogRef; Digi-Key_Part_Number: 505-AD780ARZ-ND; JLC P/N: C578527
U20 = VCB4824B0-103: Manufacturer_P/N: VCB4824SBO-10WR3; ClassName: BAT/24; Digi-Key_Part_Number: 2725-VCB4824SBO-10WR3-ND
VR1 = Volt Reg: Voltage Regulator (LF33); Manufacturer_P/N: LF33CDT-TR; ClassName: 3v3; Digi-Key_Part_Number: 497-1532-2-ND; JLC P/N: C222179
VR3 = CMP-0244-00178-1: Positive Voltage Regulator, 5V, 3-Pin DPAK, Tape and Reel; ClassName: 5V External; Digi-Key_Part_Number: 497-1203-2-ND; Manufacturer_P/N: L78M05CDT-TR; JLC P/N: C55509

## Sheet SSR.SchDoc
size C; SheetNumber: 7; SheetTotal: 15
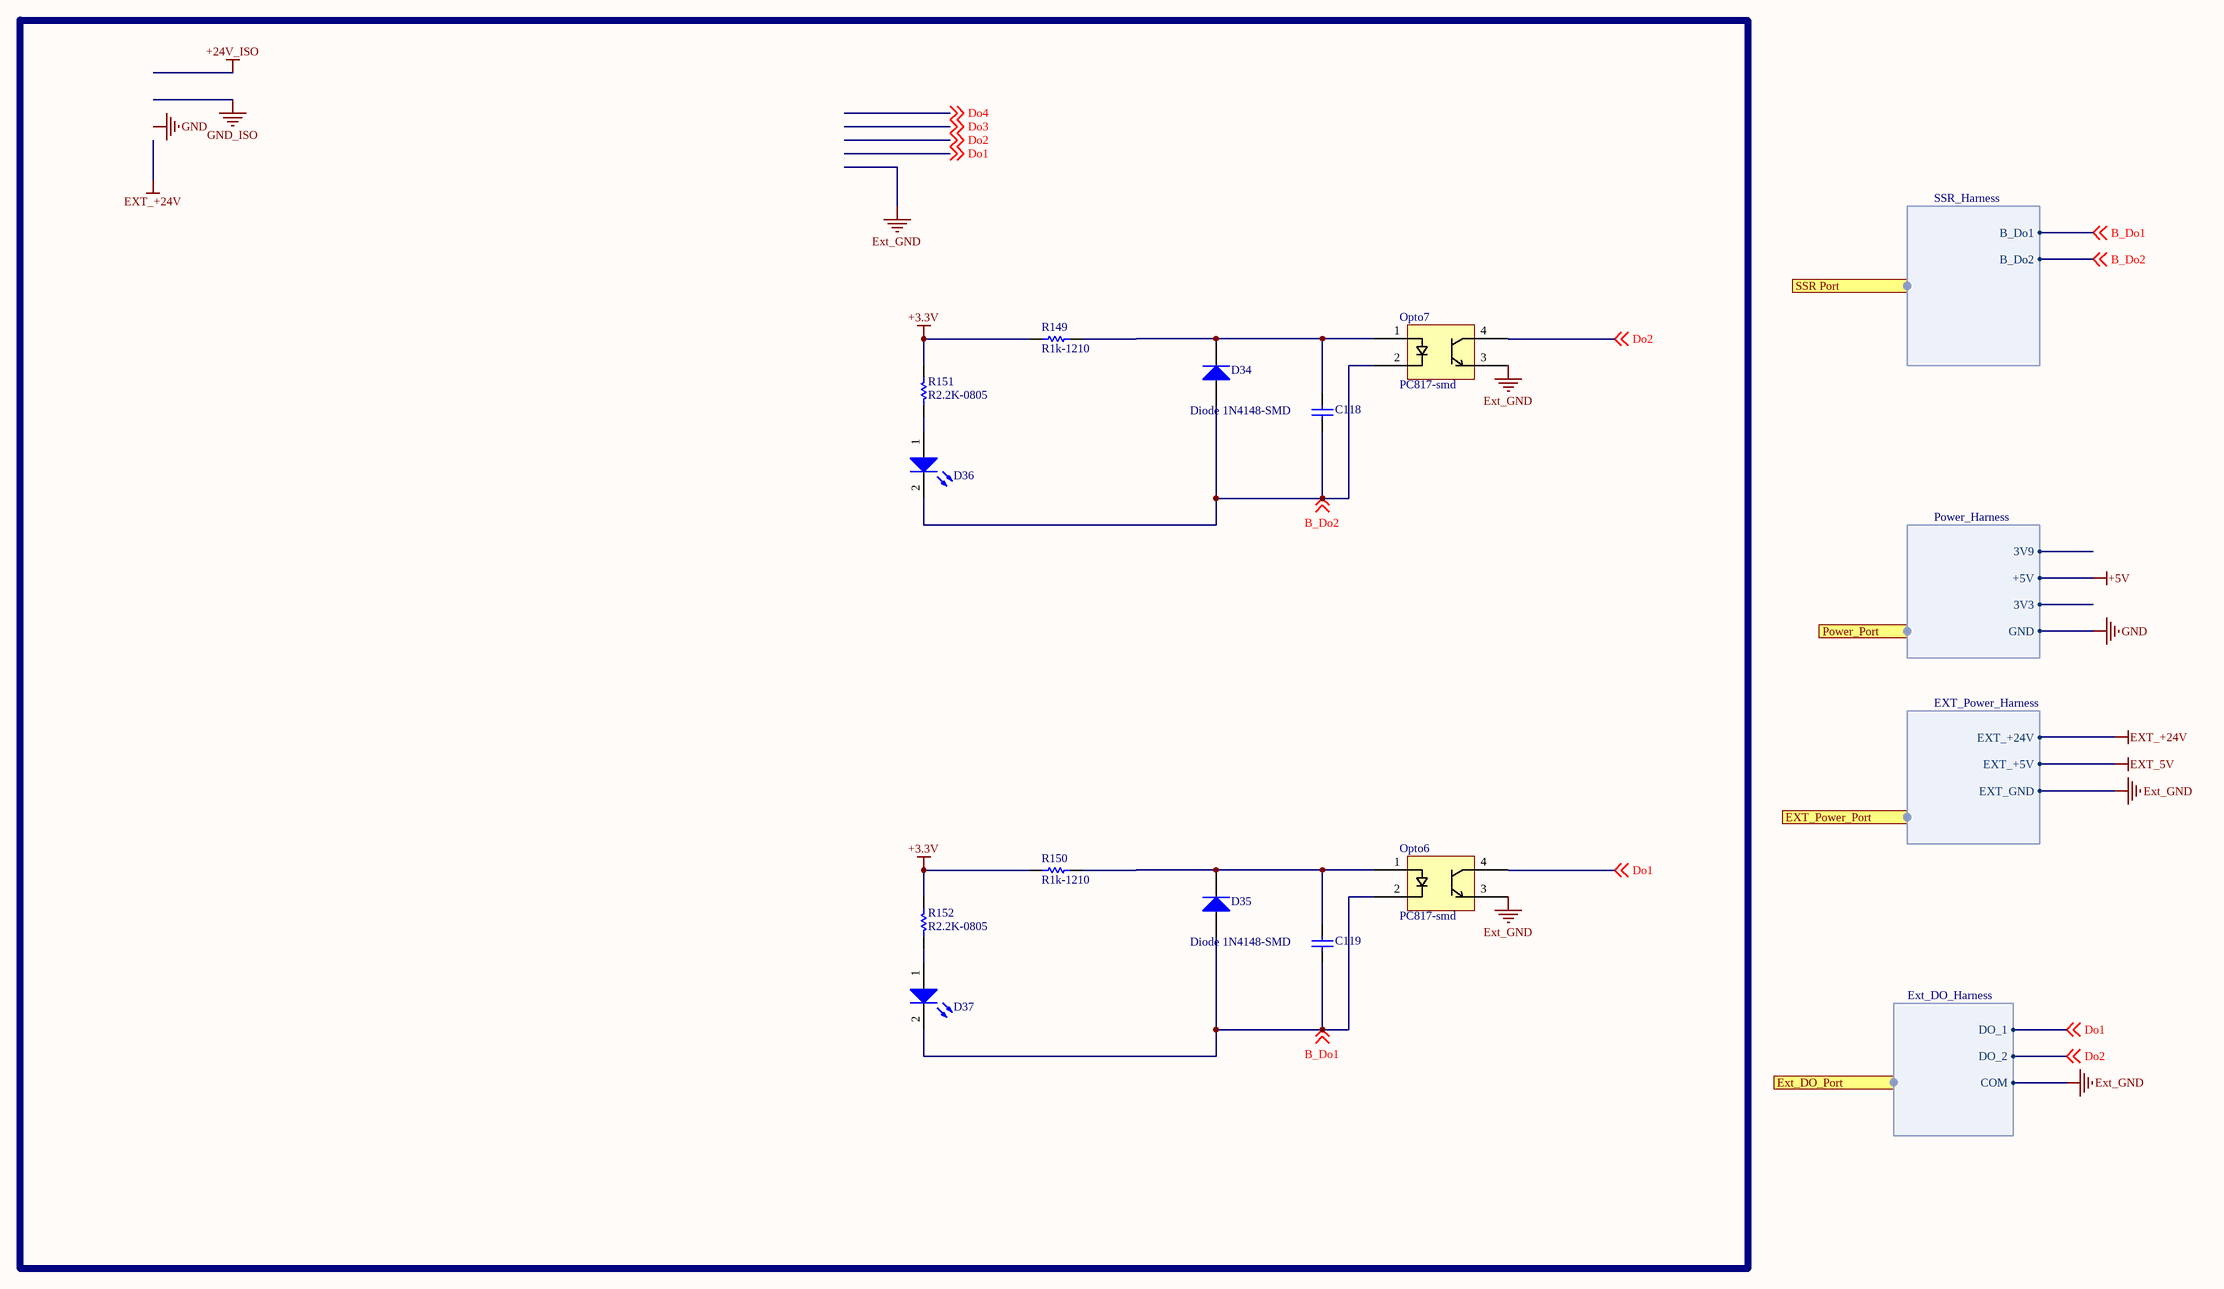
[diagram p4: SSR.SchDoc]

### Parts
C118  (no value)  [CRF06031]
C119  (no value)  [CRF06031]
D34  Diode 1N4148-SMD  [d1206]
D35  Diode 1N4148-SMD  [d1206]
D36  LED_0805_green  [0805-LED]  (value not drawn)
D37  LED_0805_green  [0805-LED]  (value not drawn)
Opto6  PC817-smd  [PC817_SMD1]
Opto7  PC817-smd  [PC817_SMD1]
R149  R1k-1210  [r1210]
R150  R1k-1210  [r1210]
R151  R2.2K-0805  [CRF06031]
R152  R2.2K-0805  [CRF06031]

### Ports
Ext_DO_Port (harness Ext_DO_Harness), EXT_Power_Port (harness EXT_Power_Harness), Power_Port (harness Power_Harness), SSR Port (harness SSR_Harness)

### Harnesses
SSR_Harness: B_Do1, B_Do2
Power_Harness: 3V9, +5V, 3V3, GND
EXT_Power_Harness: EXT_+24V, EXT_+5V, EXT_GND
Ext_DO_Harness: DO_1, DO_2, COM

### Nets
+3.3V: R149.1 R150.1 R151.2 R152.2 ; port Power_Port.3V3
Ext_GND: Opto6.3 Opto7.3 ; port EXT_Power_Port.EXT_GND, port Ext_DO_Port.COM
B_Do1: C119.1 D35.1(A) D37.2(K) Opto6.2 ; off-sheet B_Do1, port SSR Port.B_Do1
B_Do2: C118.1 D34.1(A) D36.2(K) Opto7.2 ; off-sheet B_Do2, port SSR Port.B_Do2
Do1: Opto6.4 ; off-sheet Do1, port Ext_DO_Port.DO_1
Do2: Opto7.4 ; off-sheet Do2, port Ext_DO_Port.DO_2
NetC118_2: C118.2 D34.2(K) Opto7.1 R149.2
NetC119_2: C119.2 D35.2(K) Opto6.1 R150.2
NetD36_1: D36.1(A) R151.1
NetD37_1: D37.1(A) R152.1

### Notes on the sheet
- Labels drawn without touching a wire or pin: GND

### Library data of the parts
C118 C119 = Cap: as C1 on sheet Memory; Digi-Key_Part_Number: 490-4789-1-ND; JLC P/N: C85866
D34 D35 = Diode 1N4934: 1 Amp Fast Recovery Rectifier; Manufacturer_P/N: 1N4148WS; Digi-Key_Part_Number: 1N4148WSFSTR-ND; JLC P/N: C2128
D36 D37 = LED_0805: Manufacturer_P/N: NCD0805R1; JLC P/N: C84256
Opto6 Opto7 = PC817: Manufacturer_P/N: APC-817D1-SL; Digi-Key_Part_Number: 2007-APC-817D1-SLTR-ND; JLC P/N: C17448553
R149 R150 = Res1: Resistor; Manufacturer_P/N: RC1210FR-071KL; Digi-Key_Part_Number: YAG2296TR-ND; JLC P/N: C83144
R151 R152 = Res1: as R35 on sheet Power; Digi-Key_Part_Number: 311-2.20KCRTR-ND; JLC P/N: C114561

## Sheet MCU.SchDoc
size C; SheetNumber: 5; SheetTotal: 15
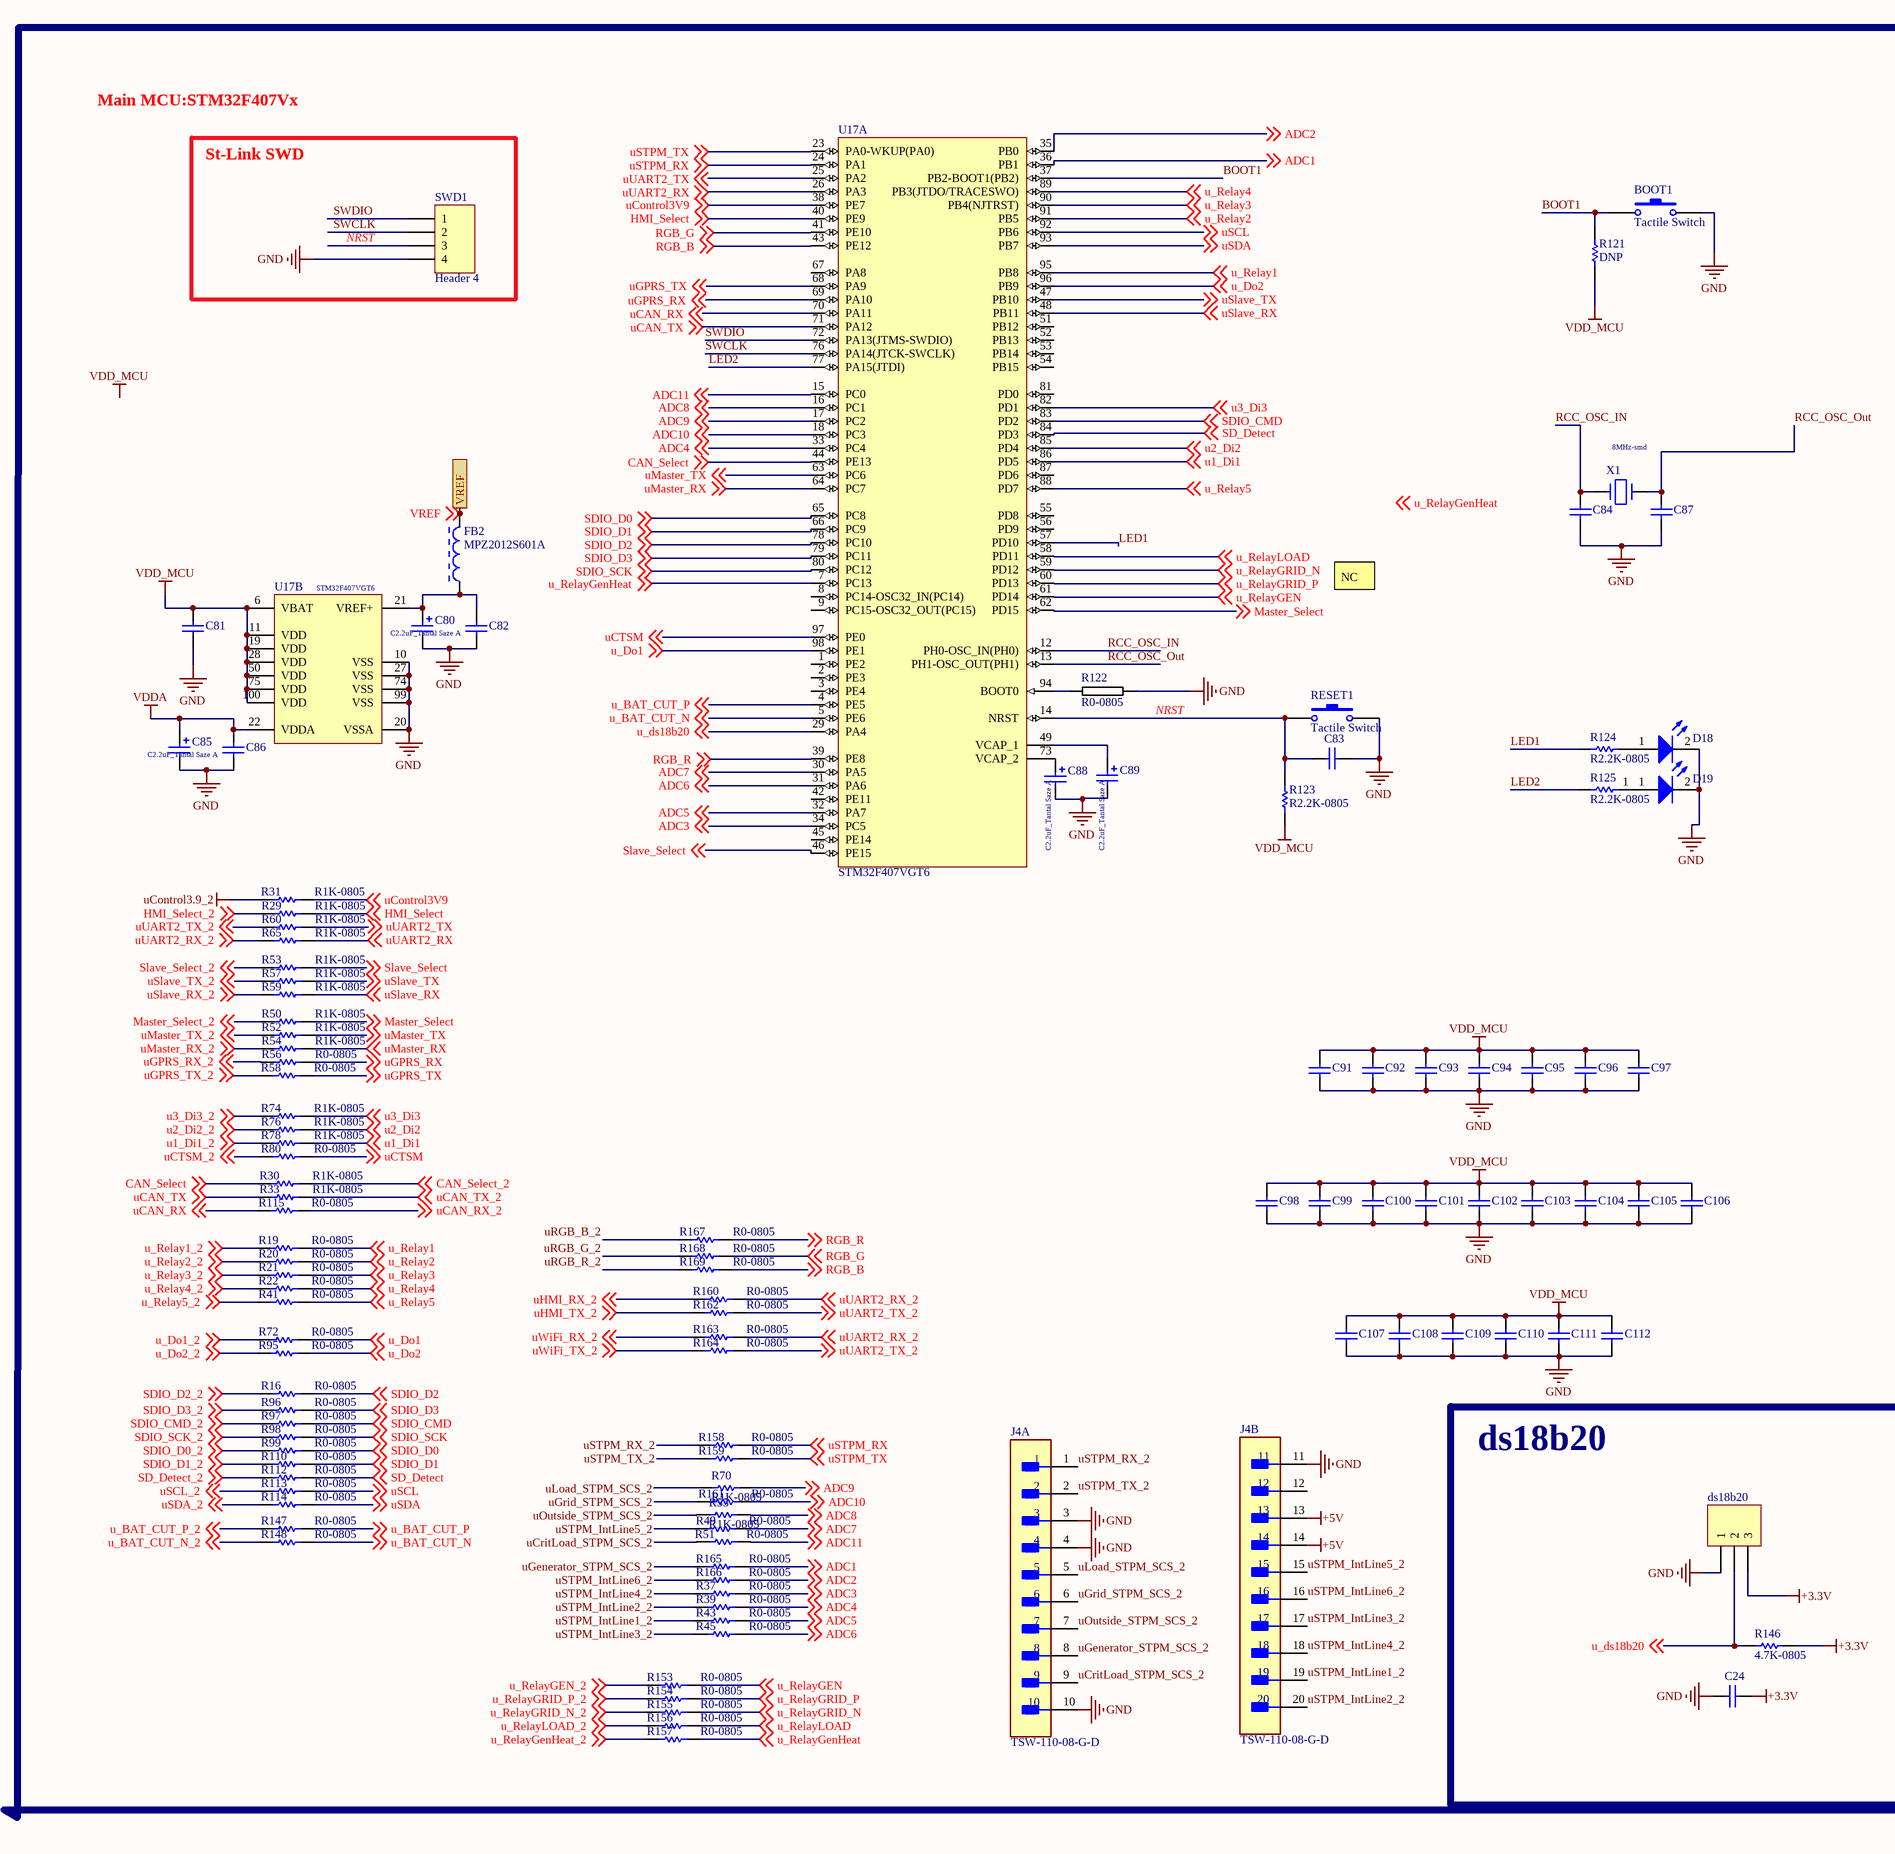
[diagram p5: MCU.SchDoc, left]
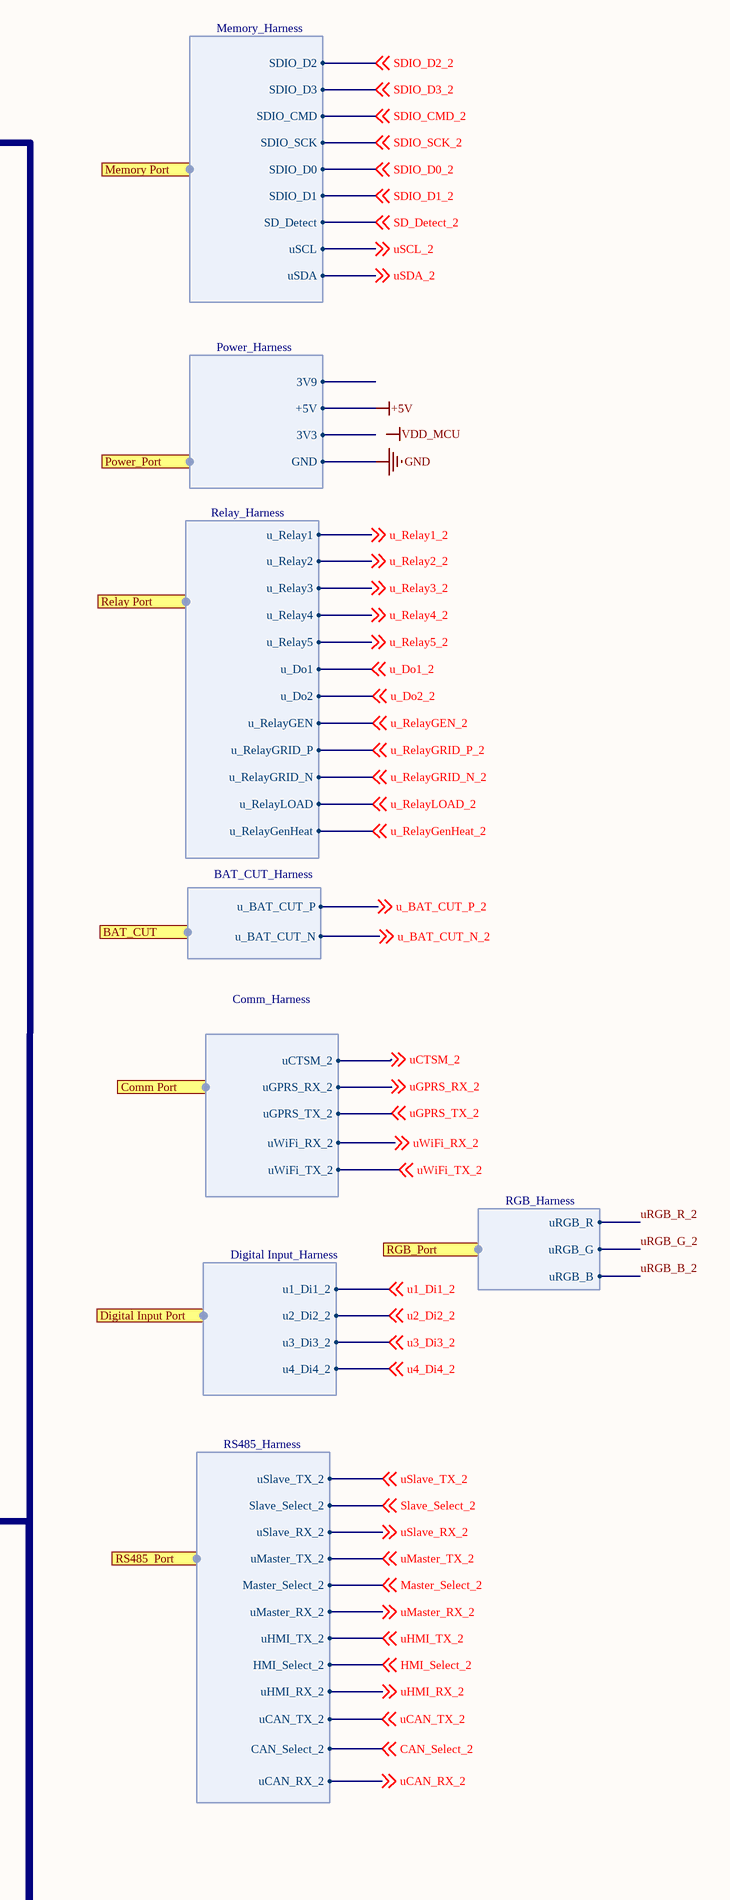
[diagram p6: MCU.SchDoc, right]

### Parts
BOOT1  Tactile Switch  [CRF06031]
C24  (no value)  [CRF06031]
C80  C2.2uF_Tantal Saze A  [Tantalium Size A]
C81  (no value)  [CRF06031]
C82  (no value)  [CRF06031]
C83  (no value)  [CRF06031]
C84  (no value)  [CRF06031]
C85  C2.2uF_Tantal Saze A  [Tantalium Size A]
C86  (no value)  [CRF06031]
C87  (no value)  [CRF06031]
C88  C2.2uF_Tantal Saze A  [Tantalium Size A]
C89  C2.2uF_Tantal Saze A  [Tantalium Size A]
C91  (no value)  [CRF06031]
C92  (no value)  [CRF06031]
C93  (no value)  [CRF06031]
C94  (no value)  [CRF06031]
C95  (no value)  [CRF06031]
C96  (no value)  [CRF06031]
C97  (no value)  [CRF06031]
C98  (no value)  [CRF06031]
C99  (no value)  [CRF06031]
C100  (no value)  [CRF06031]
C101  (no value)  [CRF06031]
C102  (no value)  [CRF06031]
C103  (no value)  [CRF06031]
C104  (no value)  [CRF06031]
C105  (no value)  [CRF06031]
C106  (no value)  [CRF06031]
C107  (no value)  [CRF06031]
C108  (no value)  [CRF06031]
C109  (no value)  [CRF06031]
C110  (no value)  [CRF06031]
C111  (no value)  [CRF06031]
C112  (no value)  [CRF06031]
D18  LED_0805_green  [0805-LED]  (value not drawn)
D19  LED_0805_red  [0805-LED]  (value not drawn)
ds18b20  LM35-DIP  [TO-92 STR]  (value not drawn)
FB2  MPZ2012S601A  [TDK-MPZ2012_V]
J4  TSW-110-08-G-D  [FP-TSW-110-08-G-D-MFG]  (parts A,B of 2)
R16  R0-0805  [CRF06031]
R19  R0-0805  [CRF06031]
R20  R0-0805  [CRF06031]
R21  R0-0805  [CRF06031]
R22  R0-0805  [CRF06031]
R29  R1K-0805  [CRF06031]
R30  R1K-0805  [CRF06031]
R31  R1K-0805  [CRF06031]
R33  R1K-0805  [CRF06031]
R37  R0-0805  [CRF06031]
R39  R0-0805  [CRF06031]
R41  R0-0805  [CRF06031]
R43  R0-0805  [CRF06031]
R45  R0-0805  [CRF06031]
R49  R0-0805  [CRF06031]
R50  R1K-0805  [CRF06031]
R51  R0-0805  [CRF06031]
R52  R1K-0805  [CRF06031]
R53  R1K-0805  [CRF06031]
R54  R1K-0805  [CRF06031]
R55  R1K-0805  [CRF06031]
R56  R0-0805  [CRF06031]
R57  R1K-0805  [CRF06031]
R58  R0-0805  [CRF06031]
R59  R1K-0805  [CRF06031]
R60  R1K-0805  [CRF06031]
R65  R1K-0805  [CRF06031]
R70  R1K-0805  [CRF06031]
R72  R0-0805  [CRF06031]
R74  R1K-0805  [CRF06031]
R76  R1K-0805  [CRF06031]
R78  R1K-0805  [CRF06031]
R80  R0-0805  [CRF06031]
R95  R0-0805  [CRF06031]
R96  R0-0805  [CRF06031]
R97  R0-0805  [CRF06031]
R98  R0-0805  [CRF06031]
R99  R0-0805  [CRF06031]
R110  R0-0805  [CRF06031]
R112  R0-0805  [CRF06031]
R113  R0-0805  [CRF06031]
R114  R0-0805  [CRF06031]
R115  R0-0805  [CRF06031]
R121  DNP  [CRF06031]
R122  R0-0805  [CRF06031]
R123  R2.2K-0805  [CRF06031]
R124  R2.2K-0805  [CRF06031]
R125  R2.2K-0805  [CRF06031]
R146  4.7K-0805  [CRF06031]
R147  R0-0805  [CRF06031]
R148  R0-0805  [CRF06031]
R153  R0-0805  [CRF06031]
R154  R0-0805  [CRF06031]
R155  R0-0805  [CRF06031]
R156  R0-0805  [CRF06031]
R157  R0-0805  [CRF06031]
R158  R0-0805  [CRF06031]
R159  R0-0805  [CRF06031]
R160  R0-0805  [CRF06031]
R161  R0-0805  [CRF06031]
R162  R0-0805  [CRF06031]
R163  R0-0805  [CRF06031]
R164  R0-0805  [CRF06031]
R165  R0-0805  [CRF06031]
R166  R0-0805  [CRF06031]
R167  R0-0805  [CRF06031]
R168  R0-0805  [CRF06031]
R169  R0-0805  [CRF06031]
RESET1  Tactile Switch  [CRF06031]
SWD1  Header 4  [HDR1X4]
U17  STM32F407VGT6  [STM-LQFP100_N]  (parts A,B of 2)
X1  8MHz-smd  [smd xtal 16M]

### Blocks framed on the sheet
St-Link SWD: SWD1

### Ports
BAT_CUT (harness BAT_CUT_Harness), Comm Port (harness Comm_Harness), Digital Input Port (harness Digital Input_Harness), Memory Port (harness Memory_Harness), Power_Port (harness Power_Harness), Relay Port (harness Relay_Harness), RGB_Port (harness RGB_Harness), RS485  Port (harness RS485_Harness), VREF

### Harnesses
Memory_Harness: SDIO_D3, SDIO_CMD, SDIO_SCK, SDIO_D0, SDIO_D1, SD_Detect, uSCL, SDIO_D2, uSDA
Power_Harness: 3V9, +5V, 3V3, GND
BAT_CUT_Harness: u_BAT_CUT_P, u_BAT_CUT_N
Digital Input_Harness: u1_Di1_2, u2_Di2_2, u3_Di3_2, u4_Di4_2
RS485_Harness: uSlave_TX_2, Slave_Select_2, uSlave_RX_2, uMaster_TX_2, Master_Select_2, uMaster_RX_2, uHMI_TX_2, HMI_Select_2, uHMI_RX_2, uCAN_TX_2, CAN_Select_2, uCAN_RX_2
Comm_Harness: uCTSM_2, uGPRS_RX_2, uGPRS_TX_2, uWiFi_TX_2, uWiFi_RX_2
Relay_Harness: u_Relay1, u_Relay2, u_Relay3, u_Relay4, u_Relay5, u_Do1, u_Do2, u_RelayGEN, u_RelayGRID_P, u_RelayGRID_N, u_RelayLOAD, u_RelayGenHeat
RGB_Harness: uRGB_R, uRGB_G, uRGB_B

### Nets
+3.3V: C24.2 ds18b20.3 R146.2 ; port Power_Port.3V3
+5V: J4.13 J4.14 ; port Power_Port.+5V
GND: BOOT1.2 C24.1 C80.2 C81.2 C82.2 C83.2 C84.1 C85.2 C86.2 C87.1 C88.2 C89.2 C91.2 C92.2 C93.2 C94.2 C95.2 C96.2 C97.2 C98.2 C99.2 C100.2 C101.2 C102.2 C103.2 C104.2 C105.2 C106.2 C107.2 C108.2 C109.2 C110.2 C111.2 C112.2 D18.2(K) D19.2(K) ds18b20.1 J4.3 J4.4 J4.10 J4.11 R122.2 RESET1.2 SWD1.4 U17.10(VSS) U17.20(VSSA) U17.27(VSS) U17.74(VSS) U17.99(VSS) ; port Power_Port.GND
uControl3.9_2: R31.2
VDD_MCU: C81.1 C91.1 C92.1 C93.1 C94.1 C95.1 C96.1 C97.1 C98.1 C99.1 C100.1 C101.1 C102.1 C103.1 C104.1 C105.1 C106.1 C107.1 C108.1 C109.1 C110.1 C111.1 C112.1 R121.1 R123.1 U17.6(VBAT) U17.11(VDD) U17.19(VDD) U17.28(VDD) U17.50(VDD) U17.75(VDD) U17.100(VDD)
VDDA: C85.1 C86.1 U17.22(VDDA)
ADC1: R165.1 U17.36(PB1) ; off-sheet ADC1
ADC2: R166.1 U17.35(PB0) ; off-sheet ADC2
ADC3: R37.1 U17.34(PC5) ; off-sheet ADC3
ADC4: R39.1 U17.33(PC4) ; off-sheet ADC4
ADC5: R43.1 U17.32(PA7) ; off-sheet ADC5
ADC6: R45.1 U17.31(PA6) ; off-sheet ADC6
ADC7: R49.1 U17.30(PA5) ; off-sheet ADC7
ADC8: R55.2 U17.16(PC1) ; off-sheet ADC8
ADC9: R70.2 U17.17(PC2) ; off-sheet ADC9
ADC10: R161.1 U17.18(PC3) ; off-sheet ADC10
ADC11: R51.2 U17.15(PC0) ; off-sheet ADC11
BOOT1: BOOT1.1 R121.2 U17.37(PB2-BOOT1(PB2))
CAN_Select: R30.2 U17.44(PE13) ; off-sheet CAN_Select
CAN_Select_2: R30.1 ; off-sheet CAN_Select_2, port RS485  Port.CAN_Select_2
HMI_Select: R29.1 U17.40(PE9) ; off-sheet HMI_Select
HMI_Select_2: R29.2 ; off-sheet HMI_Select_2, port RS485  Port.HMI_Select_2
LED1: R124.2 U17.57(PD10)
LED2: R125.2 U17.77(PA15(JTDI))
Master_Select: R50.1 U17.62(PD15) ; off-sheet Master_Select
Master_Select_2: R50.2 ; off-sheet Master_Select_2, port RS485  Port.Master_Select_2
NRST: C83.1 R123.2 RESET1.1 SWD1.3 U17.14(NRST)
RCC_OSC_IN: C84.2 U17.12(PH0-OSC_IN(PH0)) X1.1
RCC_OSC_Out: C87.2 U17.13(PH1-OSC_OUT(PH1)) X1.2
RGB_B: R169.1 U17.43(PE12) ; off-sheet RGB_B
RGB_G: R168.1 U17.41(PE10) ; off-sheet RGB_G
RGB_R: R167.1 U17.39(PE8) ; off-sheet RGB_R
SD_Detect: R112.1 U17.84(PD3) ; off-sheet SD_Detect
SD_Detect_2: R112.2 ; off-sheet SD_Detect_2, port Memory Port.SD_Detect
SDIO_CMD: R97.1 U17.83(PD2) ; off-sheet SDIO_CMD
SDIO_CMD_2: R97.2 ; off-sheet SDIO_CMD_2, port Memory Port.SDIO_CMD
SDIO_D0: R99.1 U17.65(PC8) ; off-sheet SDIO_D0
SDIO_D0_2: R99.2 ; off-sheet SDIO_D0_2, port Memory Port.SDIO_D0
SDIO_D1: R110.1 U17.66(PC9) ; off-sheet SDIO_D1
SDIO_D1_2: R110.2 ; off-sheet SDIO_D1_2, port Memory Port.SDIO_D1
SDIO_D2: R16.1 U17.78(PC10) ; off-sheet SDIO_D2
SDIO_D2_2: R16.2 ; off-sheet SDIO_D2_2, port Memory Port.SDIO_D2
SDIO_D3: R96.1 U17.79(PC11) ; off-sheet SDIO_D3
SDIO_D3_2: R96.2 ; off-sheet SDIO_D3_2, port Memory Port.SDIO_D3
SDIO_SCK: R98.1 U17.80(PC12) ; off-sheet SDIO_SCK
SDIO_SCK_2: R98.2 ; off-sheet SDIO_SCK_2, port Memory Port.SDIO_SCK
Slave_Select: R53.1 U17.46(PE15) ; off-sheet Slave_Select
Slave_Select_2: R53.2 ; off-sheet Slave_Select_2, port RS485  Port.Slave_Select_2
SWCLK: SWD1.2 U17.76(PA14(JTCK-SWCLK))
SWDIO: SWD1.1 U17.72(PA13(JTMS-SWDIO))
u1_Di1: R78.1 U17.86(PD5) ; off-sheet u1_Di1
u1_Di1_2: R78.2 ; off-sheet u1_Di1_2, port Digital Input Port.u1_Di1_2
u2_Di2: R76.1 U17.85(PD4) ; off-sheet u2_Di2
u2_Di2_2: R76.2 ; off-sheet u2_Di2_2, port Digital Input Port.u2_Di2_2
u3_Di3: R74.1 U17.82(PD1) ; off-sheet u3_Di3
u3_Di3_2: R74.2 ; off-sheet u3_Di3_2, port Digital Input Port.u3_Di3_2
u4_Di4_2: off-sheet u4_Di4_2, port Digital Input Port.u4_Di4_2
u_BAT_CUT_N: R148.1 U17.5(PE6) ; off-sheet u_BAT_CUT_N
u_BAT_CUT_N_2: R148.2 ; off-sheet u_BAT_CUT_N_2, port BAT_CUT.u_BAT_CUT_N
u_BAT_CUT_P: R147.1 U17.4(PE5) ; off-sheet u_BAT_CUT_P
u_BAT_CUT_P_2: R147.2 ; off-sheet u_BAT_CUT_P_2, port BAT_CUT.u_BAT_CUT_P
u_Do1: R72.1 U17.98(PE1) ; off-sheet u_Do1
u_Do1_2: R72.2 ; off-sheet u_Do1_2, port Relay Port.u_Do1  [project net B_Do1]
u_Do2: R95.1 U17.96(PB9) ; off-sheet u_Do2
u_Do2_2: R95.2 ; off-sheet u_Do2_2, port Relay Port.u_Do2  [project net B_Do2]
u_ds18b20: ds18b20.2 R146.1 U17.29(PA4) ; off-sheet u_ds18b20
u_Relay1: R19.1 U17.95(PB8) ; off-sheet u_Relay1
u_Relay1_2: R19.2 ; off-sheet u_Relay1_2, port Relay Port.u_Relay1
u_Relay2: R20.1 U17.91(PB5) ; off-sheet u_Relay2
u_Relay2_2: R20.2 ; off-sheet u_Relay2_2, port Relay Port.u_Relay2
u_Relay3: R21.1 U17.90(PB4(NJTRST)) ; off-sheet u_Relay3
u_Relay3_2: R21.2 ; off-sheet u_Relay3_2, port Relay Port.u_Relay3
u_Relay4: R22.1 U17.89(PB3(JTDO/TRACESWO)) ; off-sheet u_Relay4
u_Relay4_2: R22.2 ; off-sheet u_Relay4_2, port Relay Port.u_Relay4
u_Relay5: R41.1 U17.88(PD7) ; off-sheet u_Relay5
u_Relay5_2: R41.2 ; off-sheet u_Relay5_2, port Relay Port.u_Relay5
u_RelayGEN: R153.1 U17.61(PD14) ; off-sheet u_RelayGEN
u_RelayGEN_2: R153.2 ; off-sheet u_RelayGEN_2, port Relay Port.u_RelayGEN
u_RelayGenHeat: R157.1 U17.7(PC13) ; off-sheet u_RelayGenHeat
u_RelayGenHeat_2: R157.2 ; off-sheet u_RelayGenHeat_2, port Relay Port.u_RelayGenHeat
u_RelayGRID_N: R155.1 U17.59(PD12) ; off-sheet u_RelayGRID_N
u_RelayGRID_N_2: R155.2 ; off-sheet u_RelayGRID_N_2, port Relay Port.u_RelayGRID_N
u_RelayGRID_P: R154.1 U17.60(PD13) ; off-sheet u_RelayGRID_P
u_RelayGRID_P_2: R154.2 ; off-sheet u_RelayGRID_P_2, port Relay Port.u_RelayGRID_P
u_RelayLOAD: R156.1 U17.58(PD11) ; off-sheet u_RelayLOAD
u_RelayLOAD_2: R156.2 ; off-sheet u_RelayLOAD_2, port Relay Port.u_RelayLOAD
uCAN_RX: R115.2 U17.70(PA11) ; off-sheet uCAN_RX
uCAN_RX_2: R115.1 ; off-sheet uCAN_RX_2, port RS485  Port.uCAN_RX_2
uCAN_TX: R33.2 U17.71(PA12) ; off-sheet uCAN_TX
uCAN_TX_2: R33.1 ; off-sheet uCAN_TX_2, port RS485  Port.uCAN_TX_2
uControl3V9: R31.1 U17.38(PE7) ; off-sheet uControl3V9
uCritLoad_STPM_SCS_2: J4.9 R51.1
uCTSM: R80.1 U17.97(PE0) ; off-sheet uCTSM
uCTSM_2: R80.2 ; off-sheet uCTSM_2, port Comm Port.uCTSM_2
uGenerator_STPM_SCS_2: J4.8 R165.2
uGPRS_RX: R56.1 U17.69(PA10) ; off-sheet uGPRS_RX
uGPRS_RX_2: R56.2 ; off-sheet uGPRS_RX_2, port Comm Port.uGPRS_RX_2
uGPRS_TX: R58.1 U17.68(PA9) ; off-sheet uGPRS_TX
uGPRS_TX_2: R58.2 ; off-sheet uGPRS_TX_2, port Comm Port.uGPRS_TX_2
uGrid_STPM_SCS_2: J4.6 R161.2
uHMI_RX_2: R160.2 ; off-sheet uHMI_RX_2, port RS485  Port.uHMI_RX_2
uHMI_TX_2: R162.2 ; off-sheet uHMI_TX_2, port RS485  Port.uHMI_TX_2
uLoad_STPM_SCS_2: J4.5 R70.1
uMaster_RX: R54.1 U17.64(PC7) ; off-sheet uMaster_RX
uMaster_RX_2: R54.2 ; off-sheet uMaster_RX_2, port RS485  Port.uMaster_RX_2
uMaster_TX: R52.1 U17.63(PC6) ; off-sheet uMaster_TX
uMaster_TX_2: R52.2 ; off-sheet uMaster_TX_2, port RS485  Port.uMaster_TX_2
uOutside_STPM_SCS_2: J4.7 R55.1
uRGB_B_2: R167.2 ; port RGB_Port.uRGB_B
uRGB_G_2: R168.2 ; port RGB_Port.uRGB_G
uRGB_R_2: R169.2 ; port RGB_Port.uRGB_R
uSCL: R113.1 U17.92(PB6) ; off-sheet uSCL
uSCL_2: R113.2 ; off-sheet uSCL_2, port Memory Port.uSCL  [project net SCL]
uSDA: R114.1 U17.93(PB7) ; off-sheet uSDA
uSDA_2: R114.2 ; off-sheet uSDA_2, port Memory Port.uSDA  [project net SDA]
uSlave_RX: R59.1 U17.48(PB11) ; off-sheet uSlave_RX
uSlave_RX_2: R59.2 ; off-sheet uSlave_RX_2, port RS485  Port.uSlave_RX_2
uSlave_TX: R57.1 U17.47(PB10) ; off-sheet uSlave_TX
uSlave_TX_2: R57.2 ; off-sheet uSlave_TX_2, port RS485  Port.uSlave_TX_2
uSTPM_IntLine1_2: J4.19 R43.2
uSTPM_IntLine2_2: J4.20 R39.2
uSTPM_IntLine3_2: J4.17 R45.2
uSTPM_IntLine4_2: J4.18 R37.2
uSTPM_IntLine5_2: J4.15 R49.2
uSTPM_IntLine6_2: J4.16 R166.2
uSTPM_RX: R158.1 U17.24(PA1) ; off-sheet uSTPM_RX
uSTPM_RX_2: J4.1 R158.2
uSTPM_TX: R159.1 U17.23(PA0-WKUP(PA0)) ; off-sheet uSTPM_TX
uSTPM_TX_2: J4.2 R159.2
uUART2_RX: R65.1 U17.26(PA3) ; off-sheet uUART2_RX
uUART2_RX_2: R65.2 R160.1 R163.1 ; off-sheet uUART2_RX_2
uUART2_TX: R60.1 U17.25(PA2) ; off-sheet uUART2_TX
uUART2_TX_2: R60.2 R162.1 R164.1 ; off-sheet uUART2_TX_2
uWiFi_RX_2: R163.2 ; off-sheet uWiFi_RX_2, port Comm Port.uWiFi_RX_2
uWiFi_TX_2: R164.2 ; off-sheet uWiFi_TX_2, port Comm Port.uWiFi_TX_2
VREF: FB2.2 ; off-sheet VREF, port VREF
NetC80_1: C80.1 C82.1 FB2.1 U17.21(VREF+)
NetC88_1: C88.1 U17.73(VCAP_2)
NetC89_1: C89.1 U17.49(VCAP_1)
NetD18_1: D18.1(A) R124.1
NetD19_1: D19.1(A) R125.1
NetR122_1: R122.1 U17.94(BOOT0)

Not connected (* = marked no-connect by the designer): J4 12; U17 1(PE2) 2(PE3) 3(PE4) 8(PC14-OSC32_IN(PC14)) 9(PC15-OSC32_OUT(PC15)) 42(PE11) 45(PE14) 51(PB12) 52(PB13) 53(PB14) 54(PB15) 55(PD8) 56(PD9) 67(PA8) 81(PD0) 87(PD6)

### Notes on the sheet
- Main MCU:STM32F407Vx
- NC
- ds18b20
- Labels drawn without touching a wire or pin: u_RelayGenHeat, VDD_MCU

### Library data of the parts
BOOT1 RESET1 = Switch PB: Manufacturer_P/N: 430152043836; Digi-Key_Part_Number: 732-6992-2-ND; ClassName: MCU; JLC P/N: C6687535
C24 C81-C83 C86 C91-C112 = Cap: as C1 on sheet Memory; Digi-Key_Part_Number: 490-4789-1-ND; JLC P/N: C85866
  C81-C83 C86 C91-C112: ClassName: MCU
C80 C85 C88 C89 = Cap_10uF_POL_10%_TANA: Polarized Capacitor,2.2uF,10V,typeA; Manuf_1: VISHAY; Manuf_Part_1: 293D106X9010A2TE3; Manufacturer_P/N: 293D225X0016A2TE3; Revision: July-2002: Re-released for DXP Platform.; Digi-Key_Part_Number: 718-2135-2-ND; ClassName: MCU; JLC P/N: C1954029
C84 C87 = Cap: Capacitor; Manufacturer_P/N: GRM21A5C2E220JW01D; Digi-Key_Part_Number: 490-5534-2-ND; ClassName: MCU; JLC P/N: C668358
D18 D19 = LED_0805: Manufacturer_P/N: NCD0805R1; ClassName: MCU; JLC P/N: C84256
ds18b20 = Header 3: LM35-TO92; Manufacturer_P/N: DS18B20+T&R; Digi-Key_Part_Number: DS18B20+T&RTR-ND; JLC P/N: C880672
FB2 = CMP-2000-05400-1: as FB10 on sheet Memory; Manufacturer URL: http://www.tdk.com/; Product: FerriteChipBeads; Digi-Key_Part_Number: 445-MPZ2012S601AT000TR-ND; ClassName: MCU; JLC P/N: C21519
J4 = CMP-02766-000083-1: CONN HEADER VERT 20POS 2.54MM; Manufacturer Part Number: TSW-110-08-G-D; Temperature: -55°C to +125°C; Digikey Description: CONN HEADER VERT 20POS 2.54MM; Octopart: https://octopart.com/tsw-110-08-g-d-samtec-272555; Digi-Key_Part_Number: SAM1036-10-ND; Manufacturer_P/N: TSW-110-08-G-D; JLC P/N: C5804552
R16 R19-R22 R37 R39 R41 R43 R45 R49 R51 R56 R58 R72 R80 R95-R99 R110 R112-R115 R147 R148 R153-R169 = Res1: as R32 on sheet Power; Digi-Key_Part_Number: 311-0.0CRTR-ND; JLC P/N: C100045
  R16 R19-R22 R37 R39 R41 R43 R45 R49 R51 R56 R58 R72 R80 R95-R99 R110 R112-R115 R147 R148 R153-R159 R161 R165 R166: ClassName: MCU
R29-R31 R33 R50 R52-R55 R57 R59 R60 R65 R70 R74 R76 R78 = Res1: as R66 on sheet Power; Digi-Key_Part_Number: 311-1.00KCRTR-ND; ClassName: MCU; JLC P/N: C95781
R121 = Res1: ClassName: MCU
R122 = 0805R-10K: RESISTOR 0805 1/4 WATT THIN FILM; Manufacturer_P/N: RC0805FR-070RL; Digi-Key_Part_Number: 311-0.0CRTR-ND; ClassName: MCU; JLC P/N: C100045
R123-R125 = Res1: as R35 on sheet Power; Digi-Key_Part_Number: 311-2.20KCRTR-ND; ClassName: MCU; JLC P/N: C114561
R146 = Res1: as R100 on sheet Power; Digi-Key_Part_Number: 311-4.70KCRTR-ND; ClassName: MCU; JLC P/N: C60816
SWD1 = Header 4: Header, 4-Pin
U17 = STM32F407VGT6: ARM Cortex-M4 32-bit MCU+FPU, 210 DMIPS, 1024 kB Flash, 192 kB Internal RAM, 82 I/Os, 100-pin LQFP, -40 to 85 degC, Tray; Supplier 1: Digi-Key; Supplier Part Number 1: 497-11605-ND; Supplier 2: Farnell; Supplier Part Number 2: 2064368; Supplier 3: Newark; Supplier Part Number 3: 73T2333; Supplier 4: Mouser; Supplier Part Number 4: 511-STM32F407VGT6; PartNumber: STM32F407VGT6; Digi-Key_Part_Number: 497-11605-ND; ClassName: MCU_u; Manufacturer_P/N: STM32F407VGT6; JLC P/N: C12345
X1 = CRYSTAL: Manufacturer_P/N: ECS-80-20-5G3XDS-TR; Digi-Key_Part_Number: XC1494TR-ND; ClassName: MCU; JLC P/N: C2441330